# EAGLE schematic axiom_beta_power_board_v0.15_test.e9a06f0d (EAGLE 7.0.0)

## Sheet 1 of 10
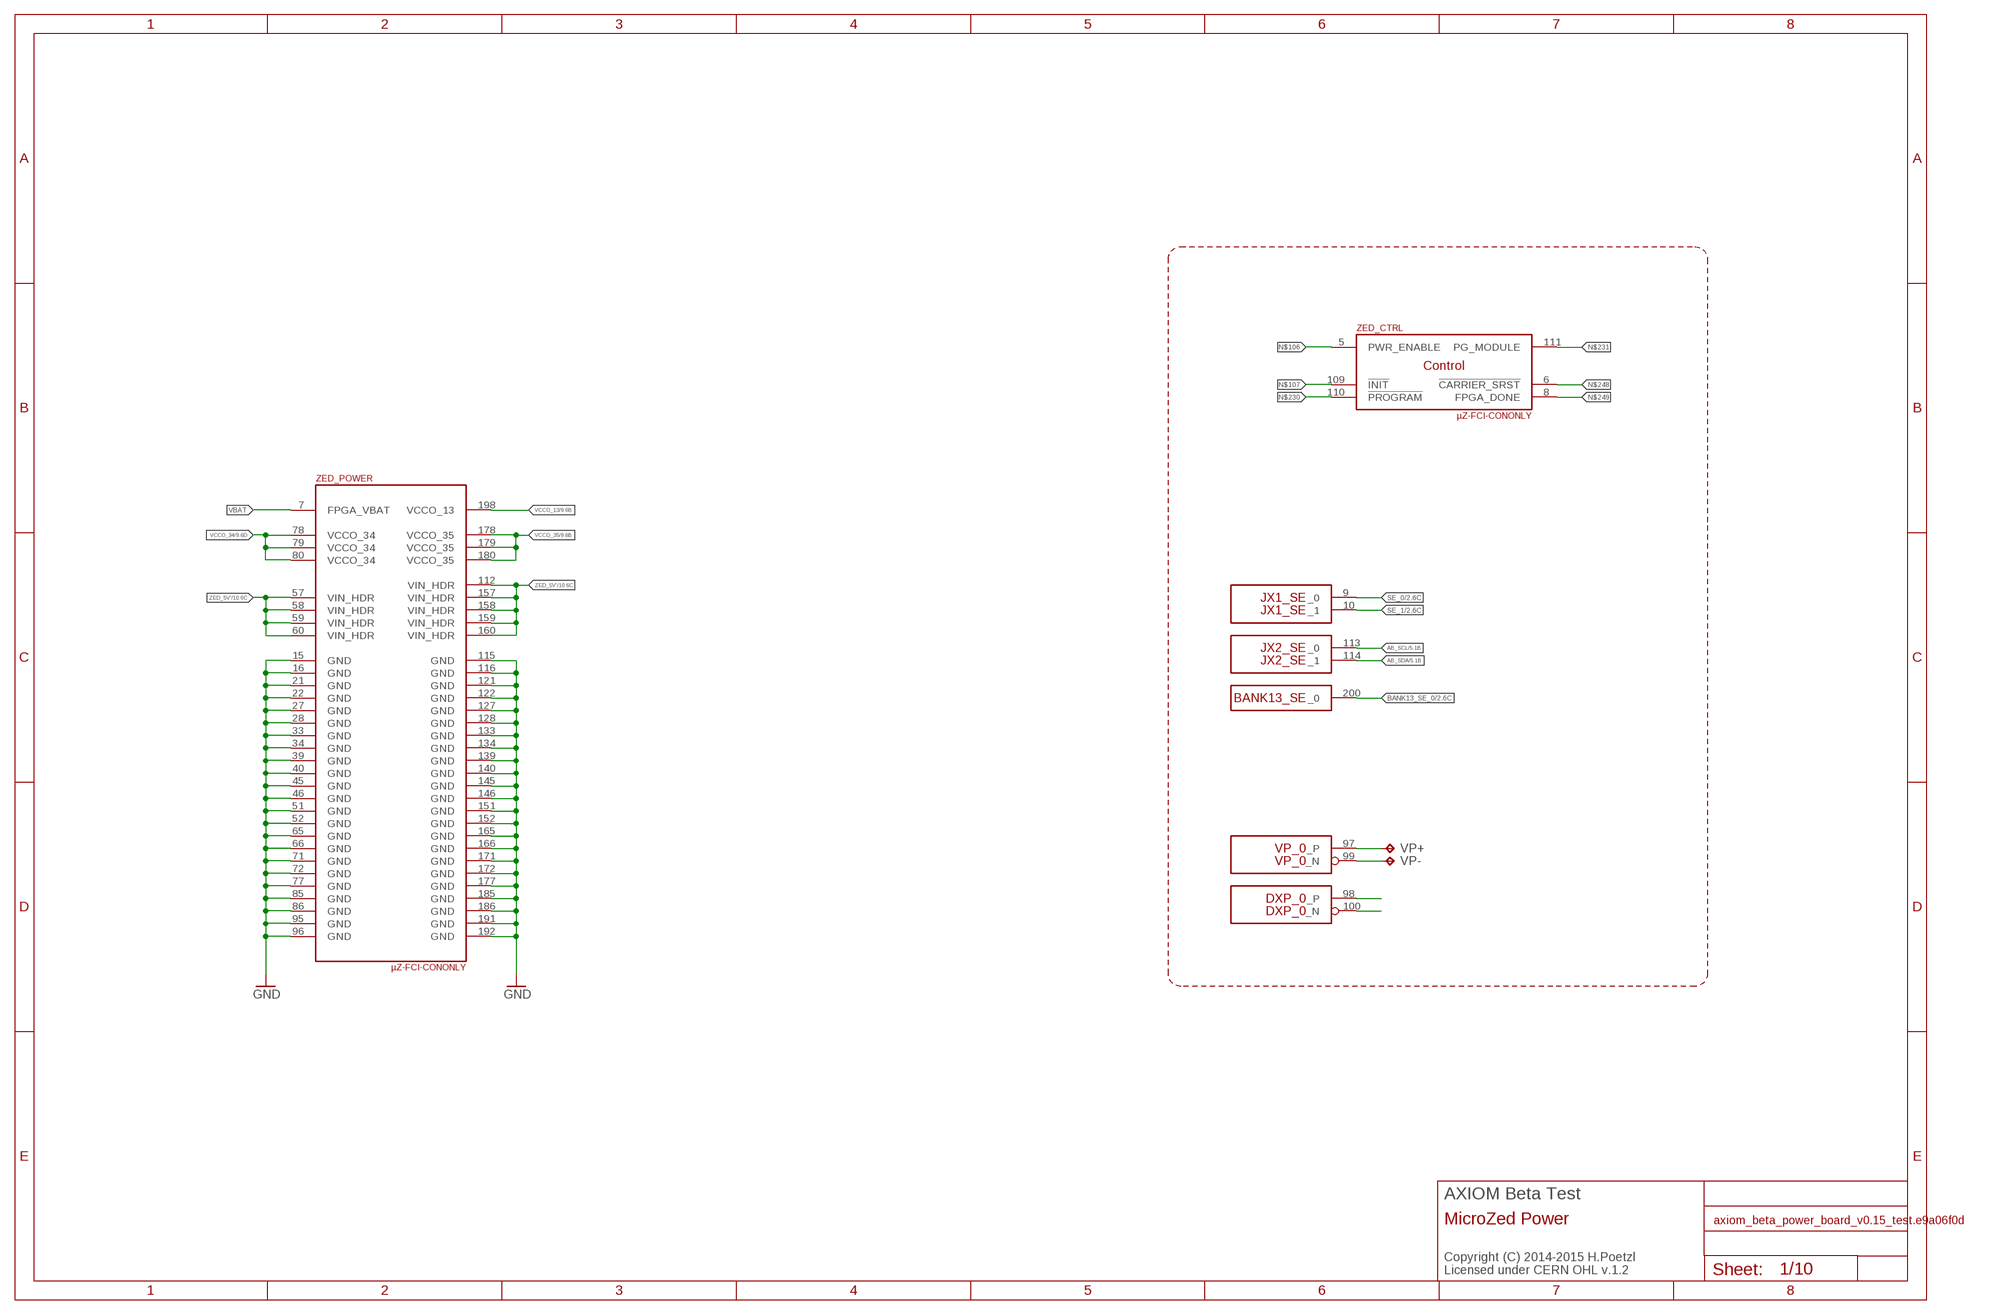
[diagram p0: schematic, sheet 1]

### Parts
VP+  TPTP16SQ  [TP16SQ]
VP-  TPTP16SQ  [TP16SQ]
ZED  µZ-FCI-CONONLY  [µZ-CONONLY]

### Nets
AB_SCL: ZED.113(JX2_SE:_0) ; also sheet 5
AB_SDA: ZED.114(JX2_SE:_1) ; also sheet 5
BANK13_SE_0: ZED.200(BANK13_SE:_0) ; also sheet 2
GND: ZED.15(_POWER:GND) ZED.16(_POWER:GND) ZED.21(_POWER:GND) ZED.22(_POWER:GND) ZED.27(_POWER:GND) ZED.28(_POWER:GND) ZED.33(_POWER:GND) ZED.34(_POWER:GND) ZED.39(_POWER:GND) ZED.40(_POWER:GND) ZED.45(_POWER:GND) ZED.46(_POWER:GND) ZED.51(_POWER:GND) ZED.52(_POWER:GND) ZED.65(_POWER:GND) ZED.66(_POWER:GND) ZED.71(_POWER:GND) ZED.72(_POWER:GND) ZED.77(_POWER:GND) ZED.85(_POWER:GND) ZED.86(_POWER:GND) ZED.95(_POWER:GND) ZED.96(_POWER:GND) ZED.115(_POWER:GND) ZED.116(_POWER:GND) ZED.121(_POWER:GND) ZED.122(_POWER:GND) ZED.127(_POWER:GND) ZED.128(_POWER:GND) ZED.133(_POWER:GND) ZED.134(_POWER:GND) ZED.139(_POWER:GND) ZED.140(_POWER:GND) ZED.145(_POWER:GND) ZED.146(_POWER:GND) ZED.151(_POWER:GND) ZED.152(_POWER:GND) ZED.165(_POWER:GND) ZED.166(_POWER:GND) ZED.171(_POWER:GND) ZED.172(_POWER:GND) ZED.177(_POWER:GND) ZED.185(_POWER:GND) ZED.186(_POWER:GND) ZED.191(_POWER:GND) ZED.192(_POWER:GND) ; also sheet 2,3,5,6,7,8,9,10
N$50: VP+.TP ZED.97(VP_0:_P)
N$51: VP-.TP ZED.99(VP_0:_N)
N$52: ZED.98(DXP_0:_P)
N$53: ZED.100(DXP_0:_N)
N$106: ZED.5(_CTRL:PWR_ENABLE)
N$107: ZED.109(_CTRL:!INIT)
N$230: ZED.110(_CTRL:!PROGRAM)
N$231: ZED.111(_CTRL:PG_MODULE)
N$248: ZED.6(_CTRL:!CARRIER_SRST)
N$249: ZED.8(_CTRL:FPGA_DONE)
SE_0: ZED.9(JX1_SE:_0) ; also sheet 2
SE_1: ZED.10(JX1_SE:_1) ; also sheet 2
VBAT: ZED.7(_POWER:FPGA_VBAT)
VCCO_13 [LVDS]: ZED.198(_POWER:VCCO_13) ; also sheet 9
VCCO_34: ZED.78(_POWER:VCCO_34) ZED.79(_POWER:VCCO_34) ZED.80(_POWER:VCCO_34) ; also sheet 9
VCCO_35: ZED.178(_POWER:VCCO_35) ZED.179(_POWER:VCCO_35) ZED.180(_POWER:VCCO_35) ; also sheet 9
ZED_5V': ZED.57(_POWER:VIN_HDR) ZED.58(_POWER:VIN_HDR) ZED.59(_POWER:VIN_HDR) ZED.60(_POWER:VIN_HDR) ZED.112(_POWER:VIN_HDR) ZED.157(_POWER:VIN_HDR) ZED.158(_POWER:VIN_HDR) ZED.159(_POWER:VIN_HDR) ZED.160(_POWER:VIN_HDR) ; also sheet 10

### Notes on the sheet
- AXIOM Beta Test
- MicroZed Power
- Copyright (C) 2014-2015 H.Poetzl
  Licensed under CERN OHL v.1.2

## Sheet 2 of 10
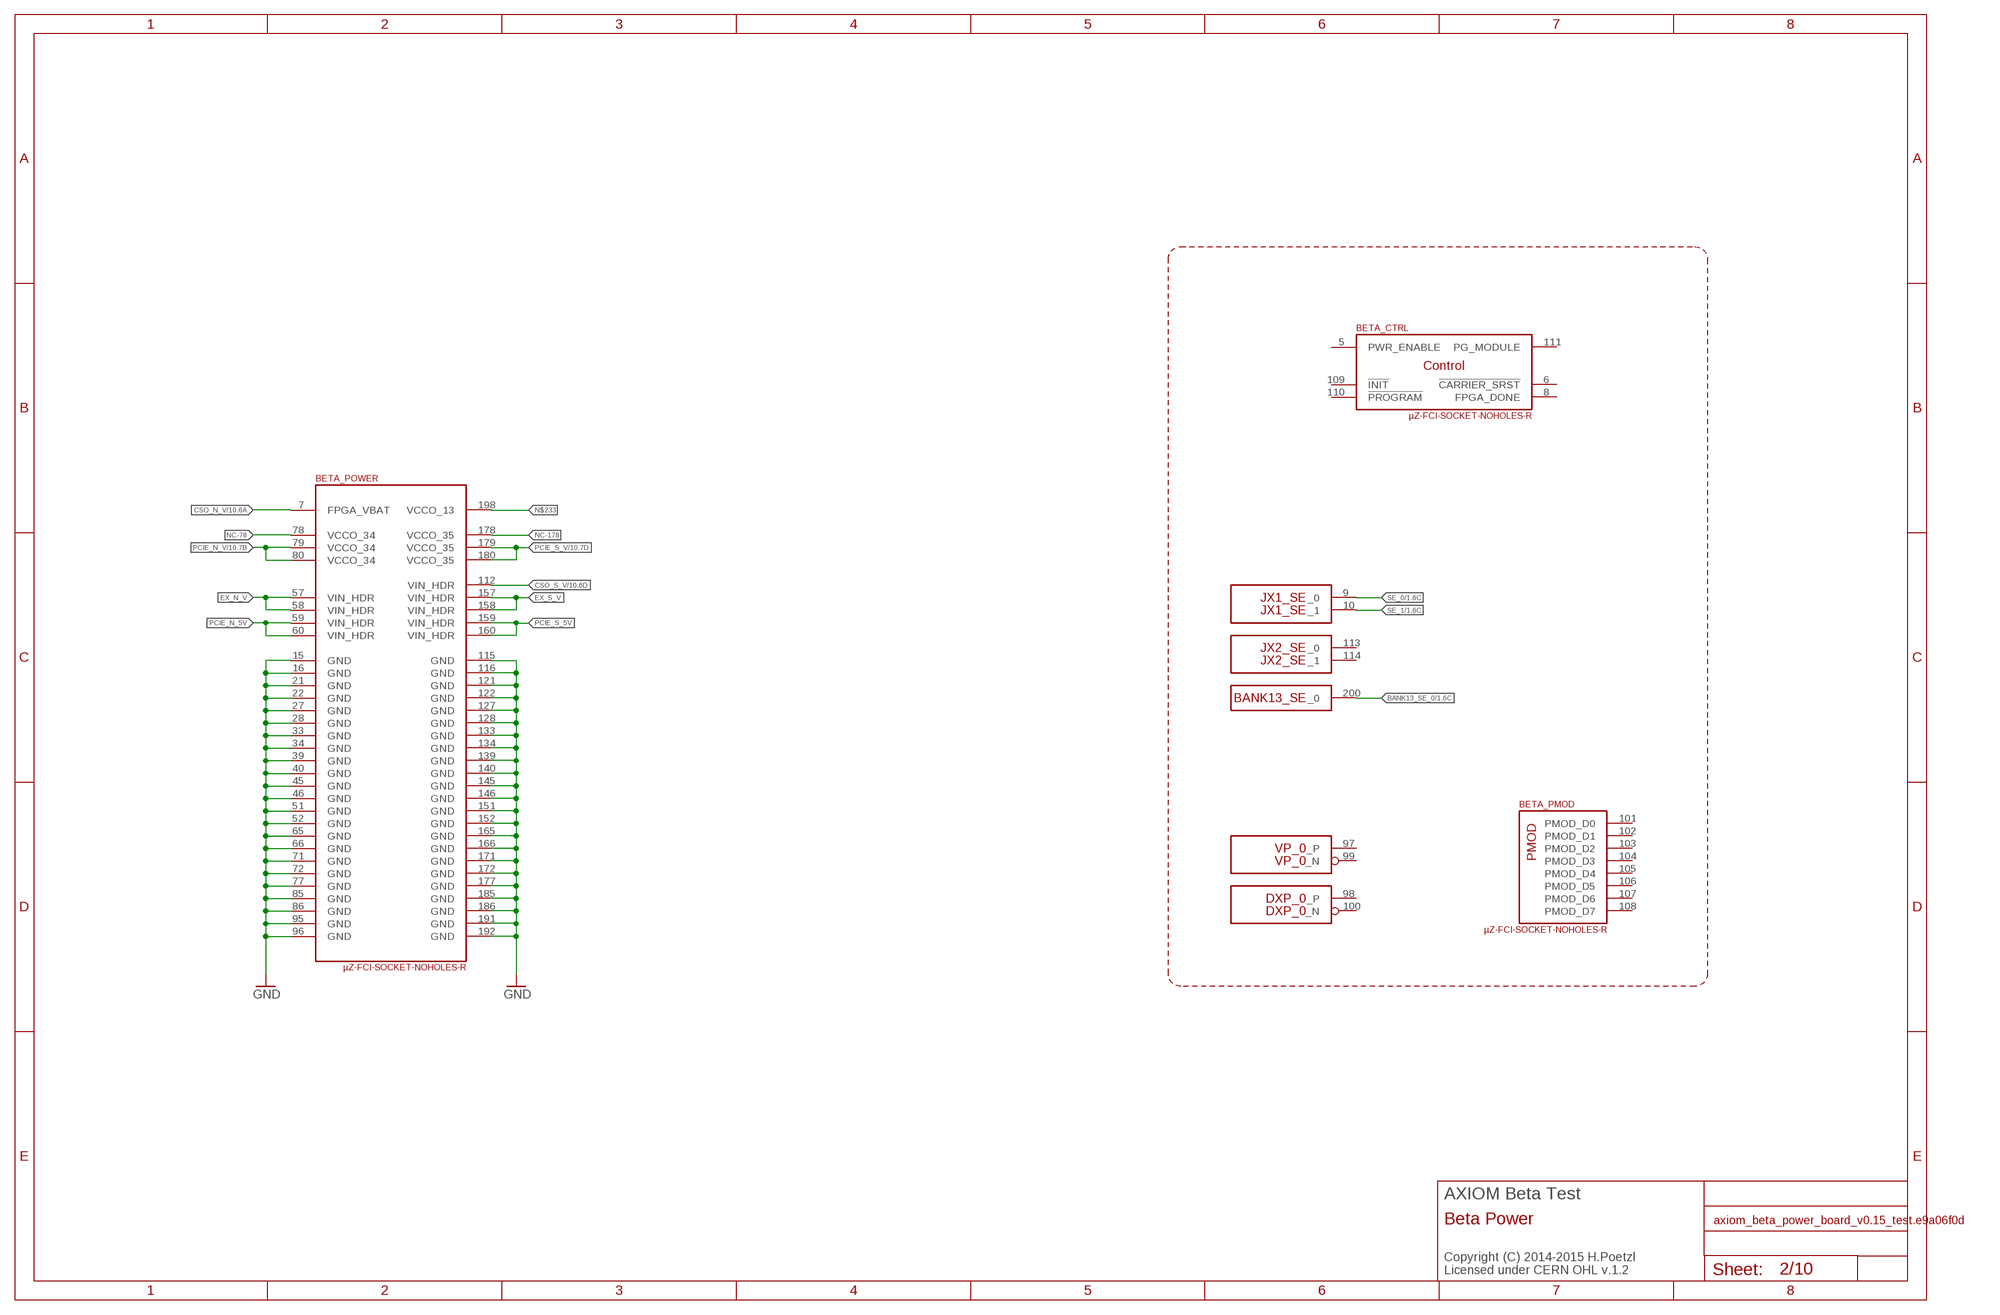
[diagram p1: schematic, sheet 2]

### Parts
BETA  µZ-FCI-SOCKET-NOHOLES-R  [µZ-SOCKET-NOHOLES-R]

### Nets
BANK13_SE_0: BETA.200(BANK13_SE:_0) ; also sheet 1
CSO_N_V: BETA.7(_POWER:FPGA_VBAT) ; also sheet 10
CSO_S_V: BETA.112(_POWER:VIN_HDR) ; also sheet 10
EX_N_V: BETA.57(_POWER:VIN_HDR) BETA.58(_POWER:VIN_HDR)
EX_S_V: BETA.157(_POWER:VIN_HDR) BETA.158(_POWER:VIN_HDR)
GND: BETA.15(_POWER:GND) BETA.16(_POWER:GND) BETA.21(_POWER:GND) BETA.22(_POWER:GND) BETA.27(_POWER:GND) BETA.28(_POWER:GND) BETA.33(_POWER:GND) BETA.34(_POWER:GND) BETA.39(_POWER:GND) BETA.40(_POWER:GND) BETA.45(_POWER:GND) BETA.46(_POWER:GND) BETA.51(_POWER:GND) BETA.52(_POWER:GND) BETA.65(_POWER:GND) BETA.66(_POWER:GND) BETA.71(_POWER:GND) BETA.72(_POWER:GND) BETA.77(_POWER:GND) BETA.85(_POWER:GND) BETA.86(_POWER:GND) BETA.95(_POWER:GND) BETA.96(_POWER:GND) BETA.115(_POWER:GND) BETA.116(_POWER:GND) BETA.121(_POWER:GND) BETA.122(_POWER:GND) BETA.127(_POWER:GND) BETA.128(_POWER:GND) BETA.133(_POWER:GND) BETA.134(_POWER:GND) BETA.139(_POWER:GND) BETA.140(_POWER:GND) BETA.145(_POWER:GND) BETA.146(_POWER:GND) BETA.151(_POWER:GND) BETA.152(_POWER:GND) BETA.165(_POWER:GND) BETA.166(_POWER:GND) BETA.171(_POWER:GND) BETA.172(_POWER:GND) BETA.177(_POWER:GND) BETA.185(_POWER:GND) BETA.186(_POWER:GND) BETA.191(_POWER:GND) BETA.192(_POWER:GND) ; also sheet 1,3,5,6,7,8,9,10
N$233: BETA.198(_POWER:VCCO_13)
NC-78: BETA.78(_POWER:VCCO_34)
NC-178: BETA.178(_POWER:VCCO_35)
PCIE_N_5V: BETA.59(_POWER:VIN_HDR) BETA.60(_POWER:VIN_HDR)
PCIE_N_V: BETA.79(_POWER:VCCO_34) BETA.80(_POWER:VCCO_34) ; also sheet 10
PCIE_S_5V: BETA.159(_POWER:VIN_HDR) BETA.160(_POWER:VIN_HDR)
PCIE_S_V: BETA.179(_POWER:VCCO_35) BETA.180(_POWER:VCCO_35) ; also sheet 10
SE_0: BETA.9(JX1_SE:_0) ; also sheet 1
SE_1: BETA.10(JX1_SE:_1) ; also sheet 1
Unconnected: BETA.5(_CTRL:PWR_ENABLE) BETA.6(_CTRL:!CARRIER_SRST) BETA.8(_CTRL:FPGA_DONE) BETA.97(VP_0:_P) BETA.98(DXP_0:_P) BETA.99(VP_0:_N) BETA.100(DXP_0:_N) BETA.101(_PMOD:PMOD_D0) BETA.102(_PMOD:PMOD_D1) BETA.103(_PMOD:PMOD_D2) BETA.104(_PMOD:PMOD_D3) BETA.105(_PMOD:PMOD_D4) BETA.106(_PMOD:PMOD_D5) BETA.107(_PMOD:PMOD_D6) BETA.108(_PMOD:PMOD_D7) BETA.109(_CTRL:!INIT) BETA.110(_CTRL:!PROGRAM) BETA.111(_CTRL:PG_MODULE) BETA.113(JX2_SE:_0) BETA.114(JX2_SE:_1)

### Notes on the sheet
- AXIOM Beta Test
- Beta Power
- Copyright (C) 2014-2015 H.Poetzl
  Licensed under CERN OHL v.1.2

## Sheet 3 of 10
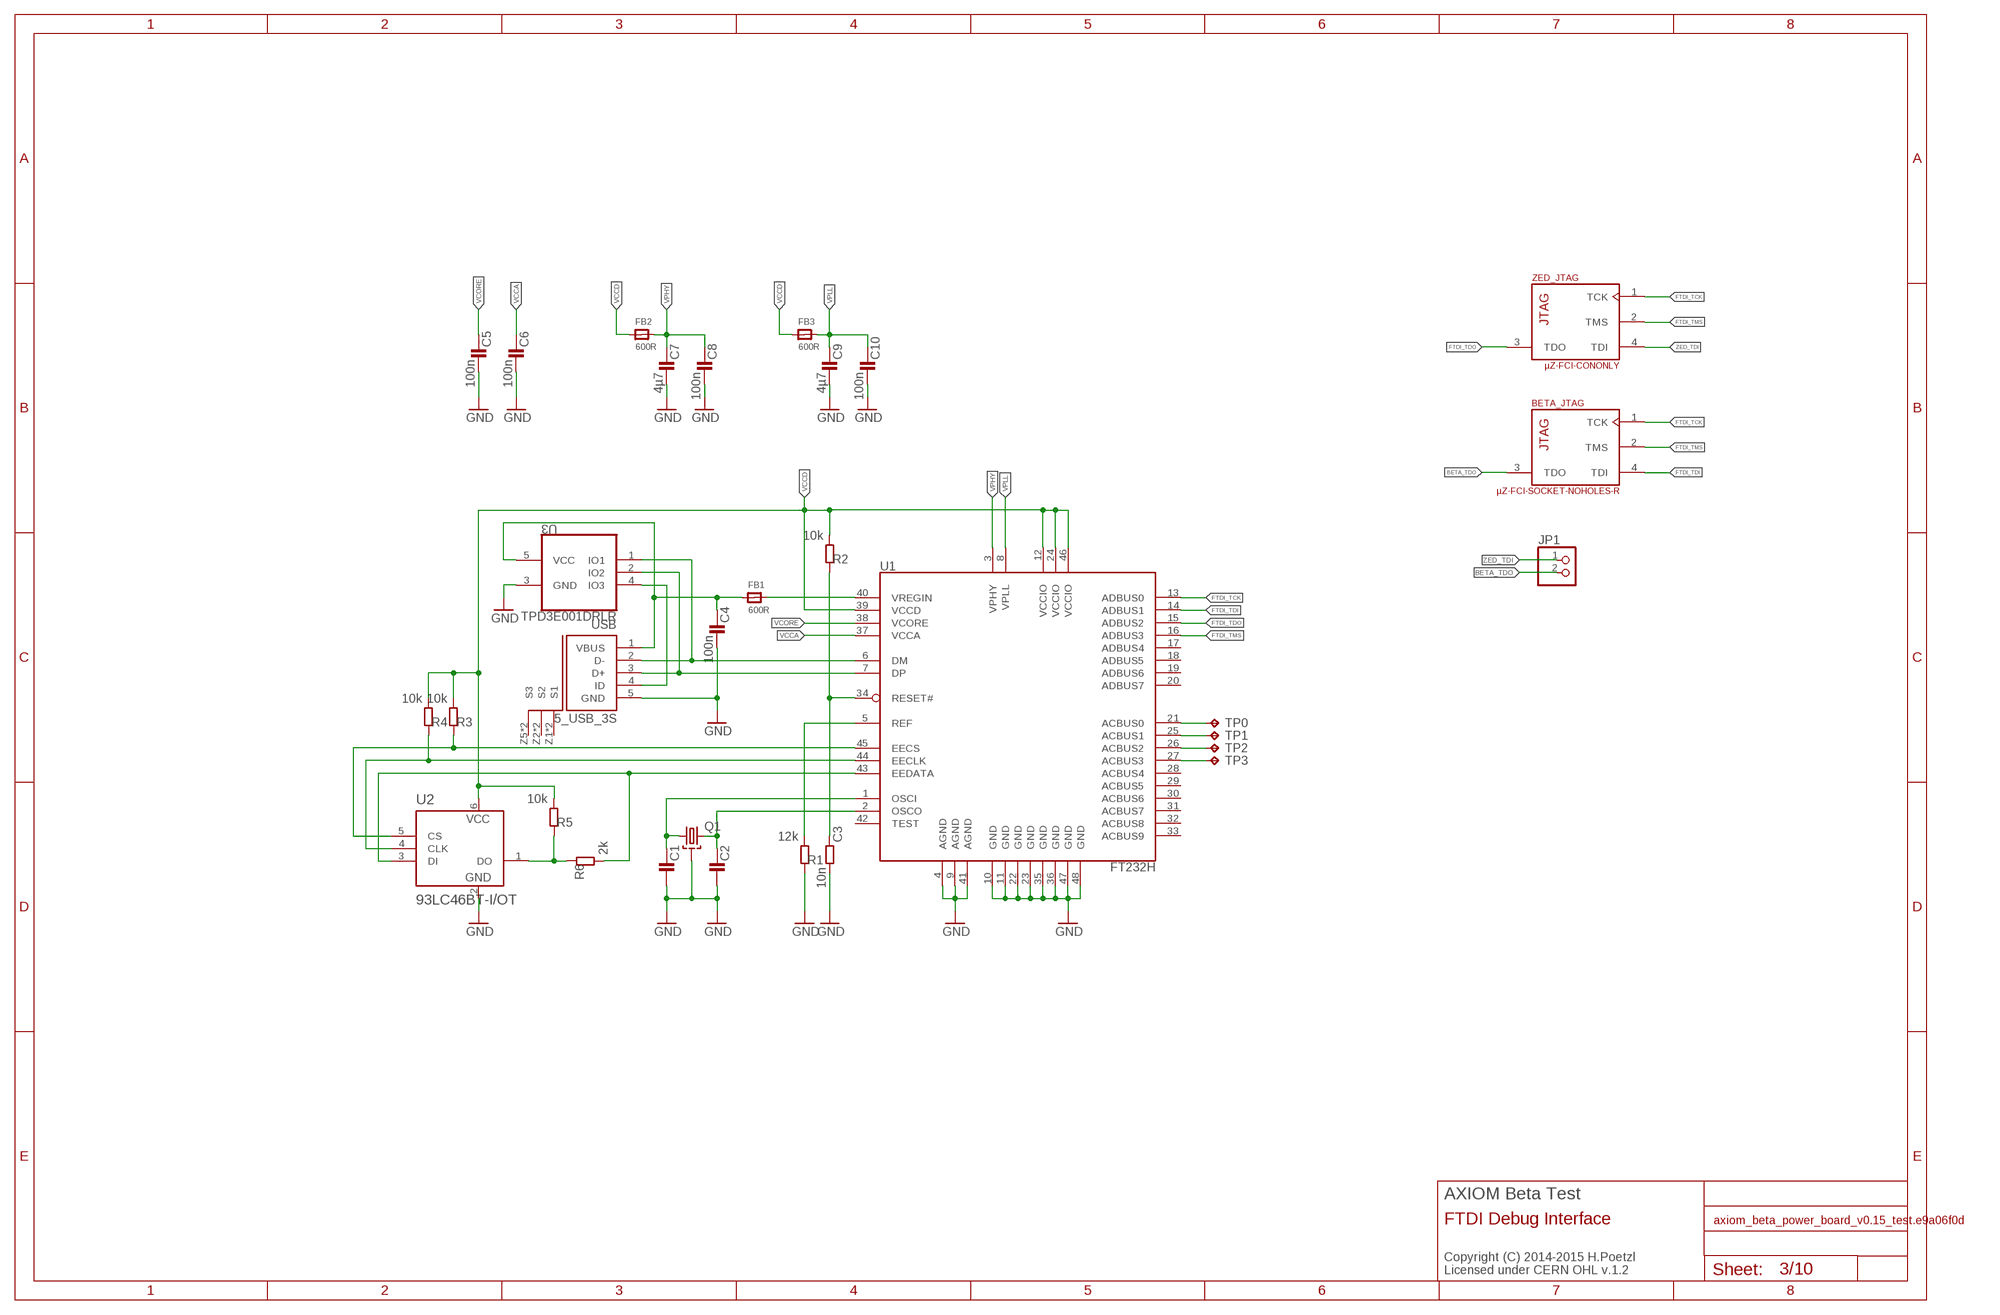
[diagram p2: schematic, sheet 3]

### Parts
C1  C0402-B  [0402-B]
C2  C0402-B  [0402-B]
C3  10n  R0402-B  [0402-B]
C4  100n  C0603-B  [0603-B]
C5  100n  C0402-B  [0402-B]
C6  100n  C0402-B  [0402-B]
C7  4µ7  C0603-B  [0603-B]
C8  100n  C0402-B  [0402-B]
C9  4µ7  C0603-B  [0603-B]
C10  100n  C0402-B  [0402-B]
FB1  600R  FERRITE_0603MP  [_0603MP]
FB2  600R  FERRITE_0603MP  [_0603MP]
FB3  600R  FERRITE_0603MP  [_0603MP]
JP1  PINHD-1X02_2.00  [1X02M]
Q1  SMD-4P-2G-3.2X2.5  [ABM8G]
R1  12k  R0402-B  [0402-B]
R2  10k  R0402-B  [0402-B]
R3  10k  R0402-B  [0402-B]
R4  10k  R0402-B  [0402-B]
R5  10k  R0402-B  [0402-B]
R6  2k  R0402-B  [0402-B]
TP0  TPTP16SQ  [TP16SQ]
TP1  TPTP16SQ  [TP16SQ]
TP2  TPTP16SQ  [TP16SQ]
TP3  TPTP16SQ  [TP16SQ]
U1  FT232H  [LQFP48]
U2  93LC46BT-I/OT  [SOT95P280X145-6N]
U3  TPD3E001DRLR  [SOT50P160X60-5N]
USB  5_USB_3S  [MICRO-AB-H-SMT]

### Nets
BETA_TDO: BETA.3(_JTAG:TDO) JP1.2
EE_CLK1: R4.1 U1.44(EECLK) U2.4(CLK)
EE_CS1: R3.1 U1.45(EECS) U2.5(CS)
EE_DATA1: R6.2 U1.43(EEDATA) U2.3(DI)
FTDI_D_N: U1.6(DM) U3.1(IO1) USB.2(D-)
FTDI_D_P: U1.7(DP) U3.2(IO2) USB.3(D+)
FTDI_TCK: BETA.1(_JTAG:TCK) U1.13(ADBUS0) ZED.1(_JTAG:TCK)
FTDI_TDI: BETA.4(_JTAG:TDI) U1.14(ADBUS1)
FTDI_TDO: U1.15(ADBUS2) ZED.3(_JTAG:TDO)
FTDI_TMS: BETA.2(_JTAG:TMS) U1.16(ADBUS3) ZED.2(_JTAG:TMS)
GND: C1.2 C2.2 C3.2 C4.2 C5.2 C6.2 C7.2 C8.2 C9.2 C10.2 Q1.2(GND) Q1.4(GND) R1.1 U1.4(AGND) U1.9(AGND) U1.10(GND) U1.11(GND) U1.22(GND) U1.23(GND) U1.35(GND) U1.36(GND) U1.41(AGND) U1.47(GND) U1.48(GND) U2.2(VSS) U3.3(GND) USB.5(GND) ; also sheet 1,2,5,6,7,8,9,10
N$35: TP1.TP U1.25(ACBUS1)
N$37: TP2.TP U1.26(ACBUS2)
N$77: TP3.TP U1.27(ACBUS3)
N$99: TP0.TP U1.21(ACBUS0)
N$177: R5.1 R6.1 U2.1(DO)
N$178: C1.1 Q1.1 U1.1(OSCI)
N$179: C2.1 Q1.3 U1.2(OSCO)
N$180: C3.1 R2.1 U1.34(RESET#)
N$181: R1.2 U1.5(REF)
N$182: U3.4(IO3) USB.4(ID)
VBUS: C4.1 FB1.1 U3.5(VCC) USB.1(VBUS)
VCCA: C6.1 U1.37(VCCA)
VCCD: FB2.1 FB3.1 R2.2 R3.2 R4.2 R5.2 U1.12(VCCIO) U1.24(VCCIO) U1.39(VCCD) U1.46(VCCIO) U2.6(VCC)
VCORE: C5.1 U1.38(VCORE)
VPHY: C7.1 C8.1 FB2.2 U1.3(VPHY)
VPLL: C9.1 C10.1 FB3.2 U1.8(VPLL)
VREGIN: FB1.2 U1.40(VREGIN)
ZED_TDI: JP1.1 ZED.4(_JTAG:TDI)
Unconnected: U1.17(ADBUS4) U1.18(ADBUS5) U1.19(ADBUS6) U1.20(ADBUS7) U1.28(ACBUS4) U1.29(ACBUS5) U1.30(ACBUS6) U1.31(ACBUS7) U1.32(ACBUS8) U1.33(ACBUS9) U1.42(TEST) USB.Z1(S1) USB.Z2(S2) USB.Z3(S2) USB.Z4(S1) USB.Z5(S3) USB.Z6(S3)

### Notes on the sheet
- AXIOM Beta Test
- FTDI Debug Interface
- Copyright (C) 2014-2015 H.Poetzl
  Licensed under CERN OHL v.1.2

## Sheet 4 of 10
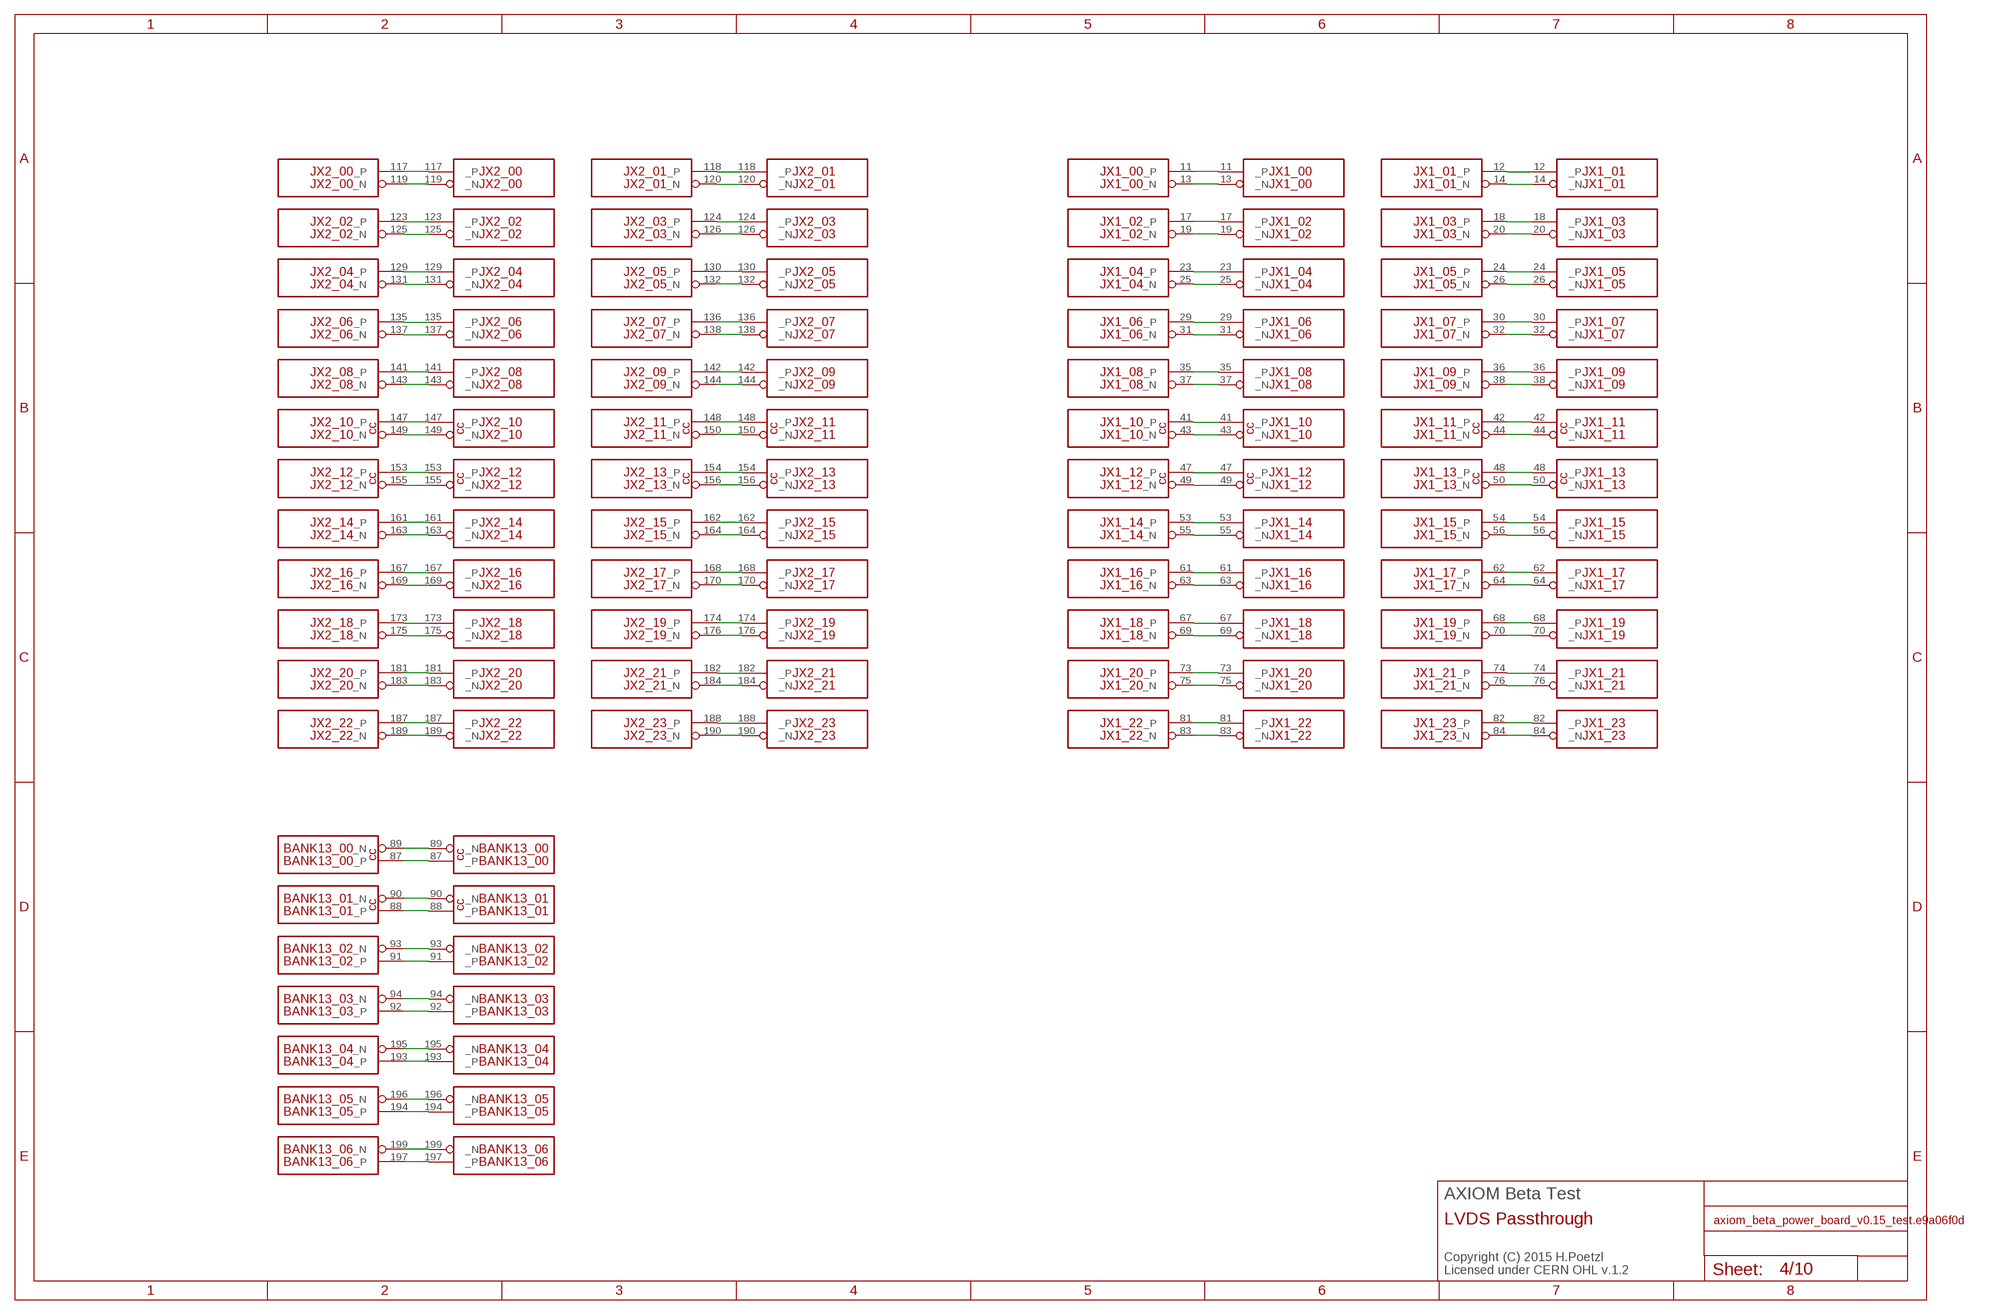
[diagram p3: schematic, sheet 4]

### Nets
BANK13_00_N [LVDS]: BETA.87(BANK13_00:_P) ZED.87(BANK13_00:_P)
BANK13_00_P [LVDS]: BETA.89(BANK13_00:_N) ZED.89(BANK13_00:_N)
BANK13_01_N [LVDS]: BETA.90(BANK13_01:_N) ZED.90(BANK13_01:_N)
BANK13_01_P [LVDS]: BETA.88(BANK13_01:_P) ZED.88(BANK13_01:_P)
BANK13_02_N [LVDS]: BETA.91(BANK13_02:_P) ZED.91(BANK13_02:_P)
BANK13_02_P [LVDS]: BETA.93(BANK13_02:_N) ZED.93(BANK13_02:_N)
BANK13_03_N [LVDS]: BETA.92(BANK13_03:_P) ZED.92(BANK13_03:_P)
BANK13_03_P [LVDS]: BETA.94(BANK13_03:_N) ZED.94(BANK13_03:_N)
BANK13_04_N [LVDS]: BETA.193(BANK13_04:_P) ZED.193(BANK13_04:_P)
BANK13_04_P [LVDS]: BETA.195(BANK13_04:_N) ZED.195(BANK13_04:_N)
BANK13_05_N: BETA.196(BANK13_05:_N) ZED.196(BANK13_05:_N)
BANK13_05_P: BETA.194(BANK13_05:_P) ZED.194(BANK13_05:_P)
BANK13_06_N [LVDS]: BETA.199(BANK13_06:_N) ZED.199(BANK13_06:_N)
BANK13_06_P [LVDS]: BETA.197(BANK13_06:_P) ZED.197(BANK13_06:_P)
JX1_00_N [LVDS]: BETA.13(JX1_00:_N) ZED.13(JX1_00:_N)
JX1_00_P [LVDS]: BETA.11(JX1_00:_P) ZED.11(JX1_00:_P)
JX1_01_N [LVDS]: BETA.14(JX1_01:_N) ZED.14(JX1_01:_N)
JX1_01_P [LVDS]: BETA.12(JX1_01:_P) ZED.12(JX1_01:_P)
JX1_02_N [LVDS]: BETA.19(JX1_02:_N) ZED.19(JX1_02:_N)
JX1_02_P [LVDS]: BETA.17(JX1_02:_P) ZED.17(JX1_02:_P)
JX1_03_N [LVDS]: BETA.20(JX1_03:_N) ZED.20(JX1_03:_N)
JX1_03_P [LVDS]: BETA.18(JX1_03:_P) ZED.18(JX1_03:_P)
JX1_04_N [LVDS]: BETA.25(JX1_04:_N) ZED.25(JX1_04:_N)
JX1_04_P [LVDS]: BETA.23(JX1_04:_P) ZED.23(JX1_04:_P)
JX1_05_N: BETA.26(JX1_05:_N) ZED.26(JX1_05:_N)
JX1_05_P: BETA.24(JX1_05:_P) ZED.24(JX1_05:_P)
JX1_06_N [LVDS]: BETA.31(JX1_06:_N) ZED.31(JX1_06:_N)
JX1_06_P [LVDS]: BETA.29(JX1_06:_P) ZED.29(JX1_06:_P)
JX1_07_N [LVDS]: BETA.32(JX1_07:_N) ZED.32(JX1_07:_N)
JX1_07_P [LVDS]: BETA.30(JX1_07:_P) ZED.30(JX1_07:_P)
JX1_08_N: BETA.37(JX1_08:_N) ZED.37(JX1_08:_N)
JX1_08_P: BETA.35(JX1_08:_P) ZED.35(JX1_08:_P)
JX1_09_N [LVDS]: BETA.38(JX1_09:_N) ZED.38(JX1_09:_N)
JX1_09_P [LVDS]: BETA.36(JX1_09:_P) ZED.36(JX1_09:_P)
JX1_10_N [LVDS]: BETA.43(JX1_10:_N) ZED.43(JX1_10:_N)
JX1_10_P [LVDS]: BETA.41(JX1_10:_P) ZED.41(JX1_10:_P)
JX1_11_N [LVDS]: BETA.44(JX1_11:_N) ZED.44(JX1_11:_N)
JX1_11_P [LVDS]: BETA.42(JX1_11:_P) ZED.42(JX1_11:_P)
JX1_12_N [LVDS]: BETA.49(JX1_12:_N) ZED.49(JX1_12:_N)
JX1_12_P [LVDS]: BETA.47(JX1_12:_P) ZED.47(JX1_12:_P)
JX1_13_N [LVDS]: BETA.50(JX1_13:_N) ZED.50(JX1_13:_N)
JX1_13_P [LVDS]: BETA.48(JX1_13:_P) ZED.48(JX1_13:_P)
JX1_14_N [LVDS]: BETA.55(JX1_14:_N) ZED.55(JX1_14:_N)
JX1_14_P [LVDS]: BETA.53(JX1_14:_P) ZED.53(JX1_14:_P)
JX1_15_N: BETA.56(JX1_15:_N) ZED.56(JX1_15:_N)
JX1_15_P: BETA.54(JX1_15:_P) ZED.54(JX1_15:_P)
JX1_16_N [LVDS]: BETA.63(JX1_16:_N) ZED.63(JX1_16:_N)
JX1_16_P [LVDS]: BETA.61(JX1_16:_P) ZED.61(JX1_16:_P)
JX1_17_N [LVDS]: BETA.64(JX1_17:_N) ZED.64(JX1_17:_N)
JX1_17_P [LVDS]: BETA.62(JX1_17:_P) ZED.62(JX1_17:_P)
JX1_18_N [LVDS]: BETA.69(JX1_18:_N) ZED.69(JX1_18:_N)
JX1_18_P [LVDS]: BETA.67(JX1_18:_P) ZED.67(JX1_18:_P)
JX1_19_N [LVDS]: BETA.70(JX1_19:_N) ZED.70(JX1_19:_N)
JX1_19_P [LVDS]: BETA.68(JX1_19:_P) ZED.68(JX1_19:_P)
JX1_20_N: BETA.75(JX1_20:_N) ZED.75(JX1_20:_N)
JX1_20_P: BETA.73(JX1_20:_P) ZED.73(JX1_20:_P)
JX1_21_N: BETA.76(JX1_21:_N) ZED.76(JX1_21:_N)
JX1_21_P: BETA.74(JX1_21:_P) ZED.74(JX1_21:_P)
JX1_22_N: BETA.83(JX1_22:_N) ZED.83(JX1_22:_N)
JX1_22_P: BETA.81(JX1_22:_P) ZED.81(JX1_22:_P)
JX1_23_N [LVDS]: BETA.84(JX1_23:_N) ZED.84(JX1_23:_N)
JX1_23_P [LVDS]: BETA.82(JX1_23:_P) ZED.82(JX1_23:_P)
JX2_00_N [LVDS]: BETA.119(JX2_00:_N) ZED.119(JX2_00:_N)
JX2_00_P [LVDS]: BETA.117(JX2_00:_P) ZED.117(JX2_00:_P)
JX2_01_N [LVDS]: BETA.120(JX2_01:_N) ZED.120(JX2_01:_N)
JX2_01_P [LVDS]: BETA.118(JX2_01:_P) ZED.118(JX2_01:_P)
JX2_02_N [LVDS]: BETA.125(JX2_02:_N) ZED.125(JX2_02:_N)
JX2_02_P [LVDS]: BETA.123(JX2_02:_P) ZED.123(JX2_02:_P)
JX2_03_N [LVDS]: BETA.126(JX2_03:_N) ZED.126(JX2_03:_N)
JX2_03_P [LVDS]: BETA.124(JX2_03:_P) ZED.124(JX2_03:_P)
JX2_04_N [LVDS]: BETA.131(JX2_04:_N) ZED.131(JX2_04:_N)
JX2_04_P [LVDS]: BETA.129(JX2_04:_P) ZED.129(JX2_04:_P)
JX2_05_N [LVDS]: BETA.132(JX2_05:_N) ZED.132(JX2_05:_N)
JX2_05_P [LVDS]: BETA.130(JX2_05:_P) ZED.130(JX2_05:_P)
JX2_06_N [LVDS]: BETA.137(JX2_06:_N) ZED.137(JX2_06:_N)
JX2_06_P [LVDS]: BETA.135(JX2_06:_P) ZED.135(JX2_06:_P)
JX2_07_N [LVDS]: BETA.138(JX2_07:_N) ZED.138(JX2_07:_N)
JX2_07_P [LVDS]: BETA.136(JX2_07:_P) ZED.136(JX2_07:_P)
JX2_08_N [LVDS]: BETA.143(JX2_08:_N) ZED.143(JX2_08:_N)
JX2_08_P [LVDS]: BETA.141(JX2_08:_P) ZED.141(JX2_08:_P)
JX2_09_N [LVDS]: BETA.144(JX2_09:_N) ZED.144(JX2_09:_N)
JX2_09_P [LVDS]: BETA.142(JX2_09:_P) ZED.142(JX2_09:_P)
JX2_10_N [LVDS]: BETA.149(JX2_10:_N) ZED.149(JX2_10:_N)
JX2_10_P [LVDS]: BETA.147(JX2_10:_P) ZED.147(JX2_10:_P)
JX2_11_N [LVDS]: BETA.150(JX2_11:_N) ZED.150(JX2_11:_N)
JX2_11_P [LVDS]: BETA.148(JX2_11:_P) ZED.148(JX2_11:_P)
JX2_12_N [LVDS]: BETA.155(JX2_12:_N) ZED.155(JX2_12:_N)
JX2_12_P [LVDS]: BETA.153(JX2_12:_P) ZED.153(JX2_12:_P)
JX2_13_N [LVDS]: BETA.156(JX2_13:_N) ZED.156(JX2_13:_N)
JX2_13_P [LVDS]: BETA.154(JX2_13:_P) ZED.154(JX2_13:_P)
JX2_14_N: BETA.163(JX2_14:_N) ZED.163(JX2_14:_N)
JX2_14_P: BETA.161(JX2_14:_P) ZED.161(JX2_14:_P)
JX2_15_N [LVDS]: BETA.164(JX2_15:_N) ZED.164(JX2_15:_N)
JX2_15_P [LVDS]: BETA.162(JX2_15:_P) ZED.162(JX2_15:_P)
JX2_16_N [LVDS]: BETA.169(JX2_16:_N) ZED.169(JX2_16:_N)
JX2_16_P [LVDS]: BETA.167(JX2_16:_P) ZED.167(JX2_16:_P)
JX2_17_N [LVDS]: BETA.170(JX2_17:_N) ZED.170(JX2_17:_N)
JX2_17_P [LVDS]: BETA.168(JX2_17:_P) ZED.168(JX2_17:_P)
JX2_18_N [LVDS]: BETA.175(JX2_18:_N) ZED.175(JX2_18:_N)
JX2_18_P [LVDS]: BETA.173(JX2_18:_P) ZED.173(JX2_18:_P)
JX2_19_N [LVDS]: BETA.176(JX2_19:_N) ZED.176(JX2_19:_N)
JX2_19_P [LVDS]: BETA.174(JX2_19:_P) ZED.174(JX2_19:_P)
JX2_20_N [LVDS]: BETA.183(JX2_20:_N) ZED.183(JX2_20:_N)
JX2_20_P [LVDS]: BETA.181(JX2_20:_P) ZED.181(JX2_20:_P)
JX2_21_N [LVDS]: BETA.184(JX2_21:_N) ZED.184(JX2_21:_N)
JX2_21_P [LVDS]: BETA.182(JX2_21:_P) ZED.182(JX2_21:_P)
JX2_22_N: BETA.189(JX2_22:_N) ZED.189(JX2_22:_N)
JX2_22_P: BETA.187(JX2_22:_P) ZED.187(JX2_22:_P)
JX2_23_N [LVDS]: BETA.190(JX2_23:_N) ZED.190(JX2_23:_N)
JX2_23_P [LVDS]: BETA.188(JX2_23:_P) ZED.188(JX2_23:_P)

### Notes on the sheet
- AXIOM Beta Test
- LVDS Passthrough
- Copyright (C) 2015 H.Poetzl
  Licensed under CERN OHL v.1.2

## Sheet 5 of 10
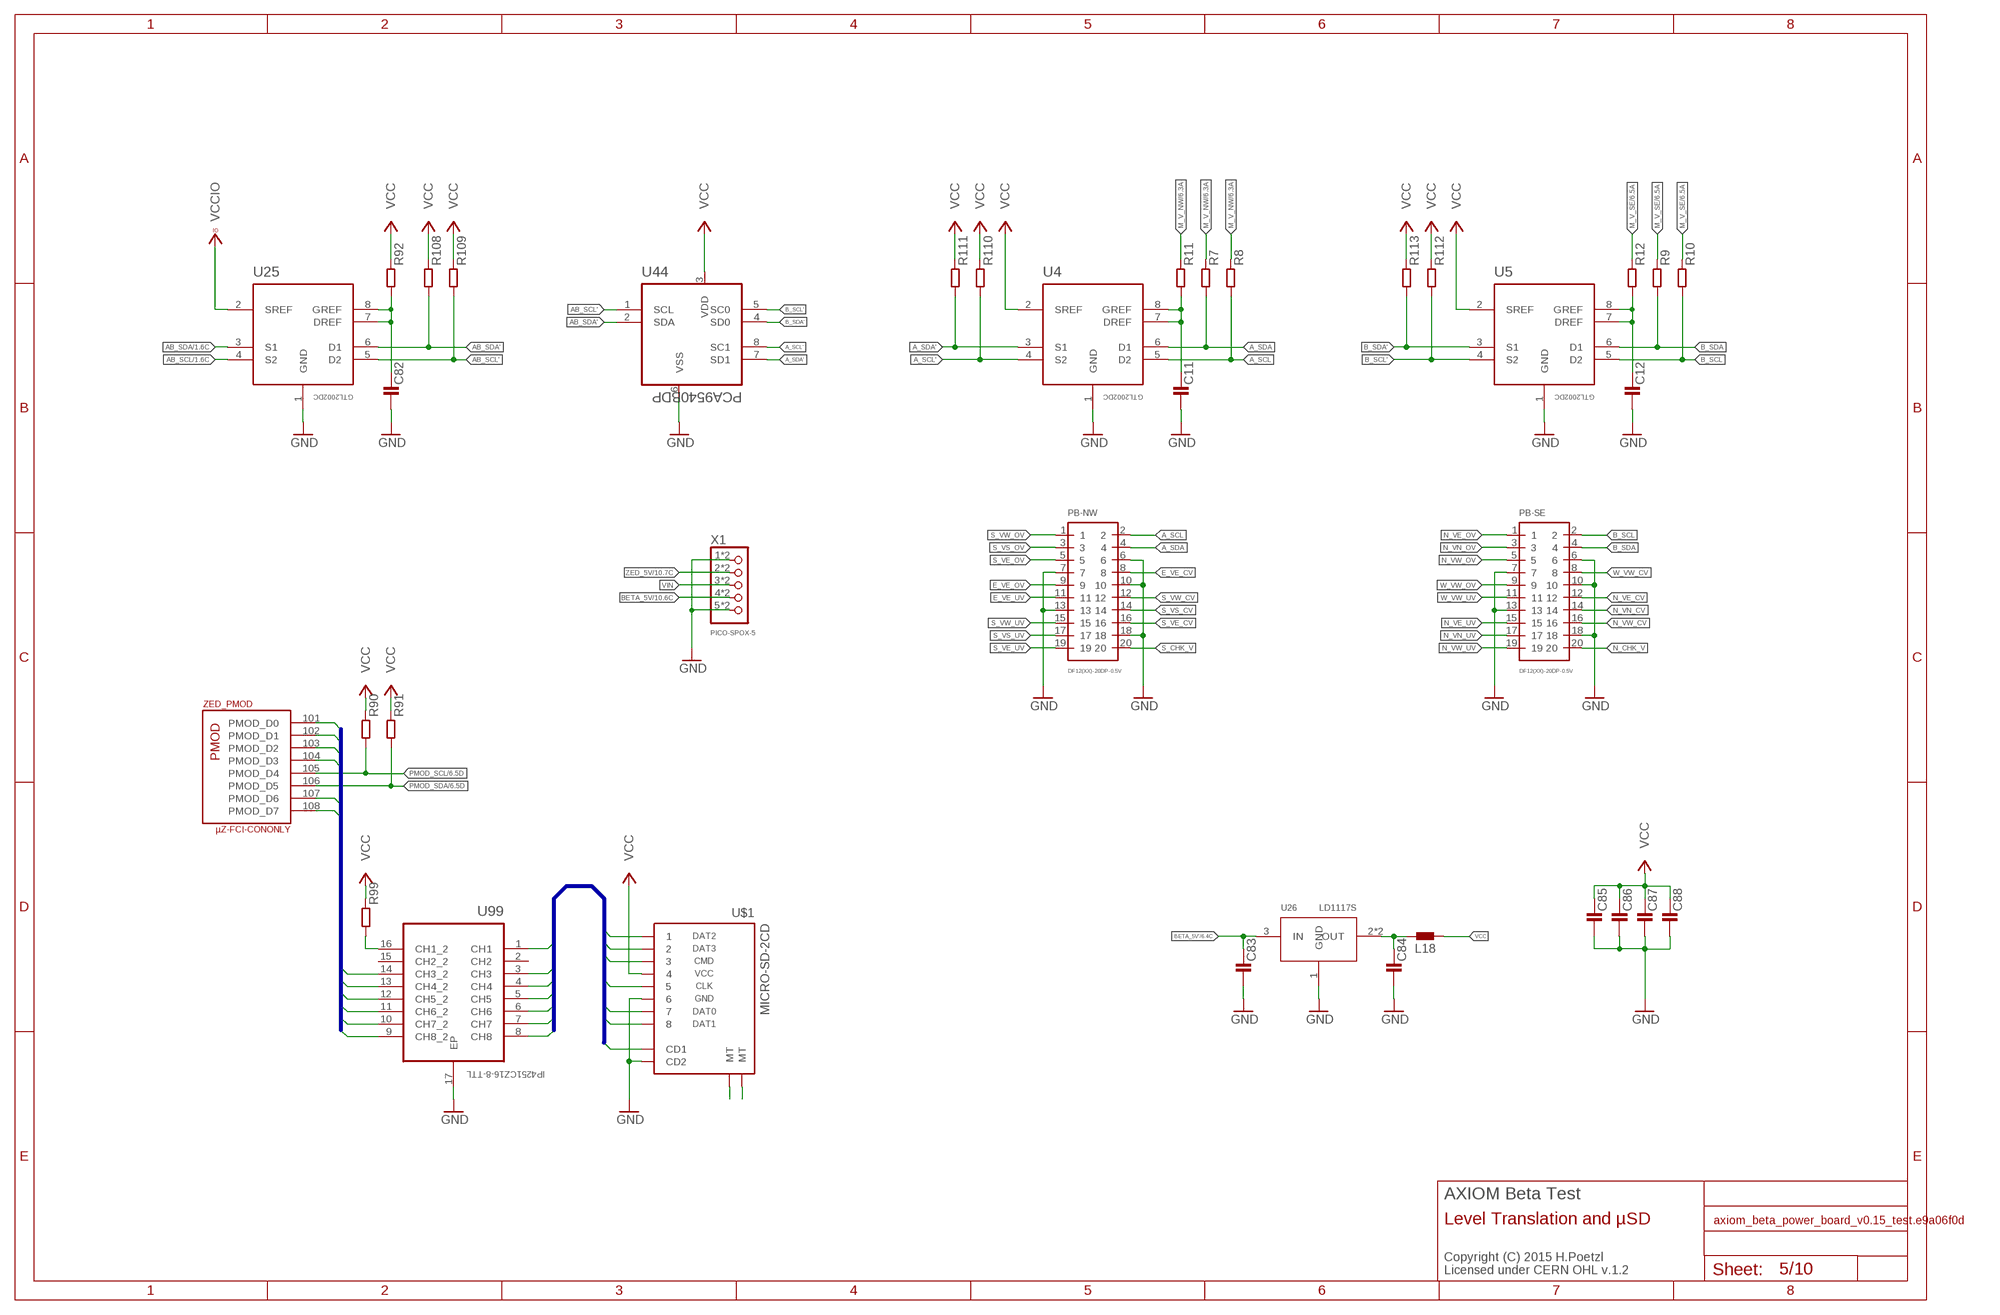
[diagram p4: schematic, sheet 5]

### Parts
C11  C0402-B  [0402-B]
C12  C0402-B  [0402-B]
C82  C0402-B  [0402-B]
C83  C0805-B  [0805-B]
C84  C0805-B  [0805-B]
C85  C0402-B  [0402-B]
C86  C0402-B  [0402-B]
C87  C0402-B  [0402-B]
C88  C0402-B  [0402-B]
L18  L0805-A  [0805-A]
PB-NW  DF12(XX)-20DP-0.5V  [DF12(XX)-20DP-0.5V]
PB-SE  DF12(XX)-20DP-0.5V  [DF12(XX)-20DP-0.5V]
R7  R0402-B  [0402-B]
R8  R0402-B  [0402-B]
R9  R0402-B  [0402-B]
R10  R0402-B  [0402-B]
R11  R0402-B  [0402-B]
R12  R0402-B  [0402-B]
R90  R0402-B  [0402-B]
R91  R0402-B  [0402-B]
R92  R0402-B  [0402-B]
R99  R0402-B  [0402-B]
R108  R0402-B  [0402-B]
R109  R0402-B  [0402-B]
R110  R0402-B  [0402-B]
R111  R0402-B  [0402-B]
R112  R0402-B  [0402-B]
R113  R0402-B  [0402-B]
U4  GTL2002DC  [VSSOP-8]
U5  GTL2002DC  [VSSOP-8]
U25  GTL2002DC  [VSSOP-8]
U26  LD1117S  [SOT-223]
U44  PCA9540BDP  [SOP65P490X110-8N]
U99  IP4251CZ16-8-TTL  [SON40P135X330X55-17N]
U$1  MICRO-SD-2CD  [TF-MICRO-SD_PP2]
X1  PICO-SPOX-5  [PICO-SPOX-5]

### Nets
A_SCL: PB-NW.2 R8.2 U4.5(D2)
A_SCL': R110.2 U4.4(S2) U44.8(SC1)
A_SDA: PB-NW.4 R7.2 U4.6(D1)
A_SDA': R111.2 U4.3(S1) U44.7(SD1)
AB_SCL: U25.4(S2) ; also sheet 1
AB_SCL': R109.2 U25.5(D2) U44.1(SCL)
AB_SDA: U25.3(S1) ; also sheet 1
AB_SDA': R108.2 U25.6(D1) U44.2(SDA)
B_SCL: PB-SE.2 R10.2 U5.5(D2)
B_SCL': R112.2 U5.4(S2) U44.5(SC0)
B_SDA: PB-SE.4 R9.2 U5.6(D1)
B_SDA': R113.2 U5.3(S1) U44.4(SD0)
BETA_5V: X1.4 X1.4A ; also sheet 10
BETA_5V': C83.1 U26.3(IN) ; also sheet 6,7,8,10
CD: U99.1(CH1) U$1.CD1
CLK: U99.6(CH6) U$1.5
CMD: U99.5(CH5) U$1.3
DAT0: U99.7(CH7) U$1.7
DAT1: U99.8(CH8) U$1.8
DAT2: U99.3(CH3) U$1.1
DAT3: U99.4(CH4) U$1.2
E_VE_CV: PB-NW.8
E_VE_OV: PB-NW.9
E_VE_UV: PB-NW.11
GND: C11.2 C12.2 C82.2 C83.2 C84.2 C85.2 C86.2 C87.2 C88.2 PB-NW.6 PB-NW.7 PB-NW.10 PB-NW.13 PB-NW.18 PB-SE.6 PB-SE.7 PB-SE.10 PB-SE.13 PB-SE.18 U4.1(GND) U5.1(GND) U25.1(GND) U26.1(GND) U44.6(VSS) U99.17(EP) U$1.6 U$1.CD2 X1.1 X1.1A X1.5 X1.5A ; also sheet 1,2,3,6,7,8,9,10
M_V_NW: R7.1 R8.1 R11.1 ; also sheet 6,7
M_V_SE: R9.1 R10.1 R12.1 ; also sheet 6,7
N$32: C11.1 R11.2 U4.7(DREF) U4.8(GREF)
N$33: C12.1 R12.2 U5.7(DREF) U5.8(GREF)
N$86: R99.2 U99.16(CH1_2)
N$118: U$1.MT2(MT)
N$124: U$1.MT1(MT)
N$1006: C82.1 R92.2 U25.7(DREF) U25.8(GREF)
N_CHK_V: PB-SE.20
N_VE_CV: PB-SE.12
N_VE_OV: PB-SE.1
N_VE_UV: PB-SE.15
N_VN_CV: PB-SE.14
N_VN_OV: PB-SE.3
N_VN_UV: PB-SE.17
N_VW_CV: PB-SE.16
N_VW_OV: PB-SE.5
N_VW_UV: PB-SE.19
PMOD_D0: U99.9(CH8_2) ZED.101(_PMOD:PMOD_D0)
PMOD_D1: U99.10(CH7_2) ZED.102(_PMOD:PMOD_D1)
PMOD_D2: U99.12(CH5_2) ZED.103(_PMOD:PMOD_D2)
PMOD_D3: U99.11(CH6_2) ZED.104(_PMOD:PMOD_D3)
PMOD_D6: U99.14(CH3_2) ZED.107(_PMOD:PMOD_D6)
PMOD_D7: U99.13(CH4_2) ZED.108(_PMOD:PMOD_D7)
PMOD_SCL: R90.2 ZED.105(_PMOD:PMOD_D4) ; also sheet 6,7,8,9,10
PMOD_SDA: R91.2 ZED.106(_PMOD:PMOD_D5) ; also sheet 6,7,8,9,10
REGOUT: C84.1 L18.1 U26.2(OUT) U26.TER(OUT)
S_CHK_V: PB-NW.20
S_VE_CV: PB-NW.16
S_VE_OV: PB-NW.5
S_VE_UV: PB-NW.19
S_VS_CV: PB-NW.14
S_VS_OV: PB-NW.3
S_VS_UV: PB-NW.17
S_VW_CV: PB-NW.12
S_VW_OV: PB-NW.1
S_VW_UV: PB-NW.15
VCC: C85.1 C86.1 C87.1 C88.1 L18.2 R90.1 R91.1 R92.1 R99.1 R108.1 R109.1 R110.1 R111.1 R112.1 R113.1 U4.2(SREF) U5.2(SREF) U44.3(VDD) U$1.4 ; also sheet 6,7,8,9,10
VCCIO: U25.2(SREF) ; also sheet 9,10
VIN: X1.3 X1.3A
W_VW_CV: PB-SE.8
W_VW_OV: PB-SE.9
W_VW_UV: PB-SE.11
ZED_5V: X1.2 X1.2A ; also sheet 10
Unconnected: U99.2(CH2) U99.15(CH2_2)

### Buses
PMOD_D[0..7]
CMD,CLK,DAT[0..3],CD

### Notes on the sheet
- AXIOM Beta Test
- Level Translation and µSD
- Copyright (C) 2015 H.Poetzl
  Licensed under CERN OHL v.1.2

## Sheet 6 of 10
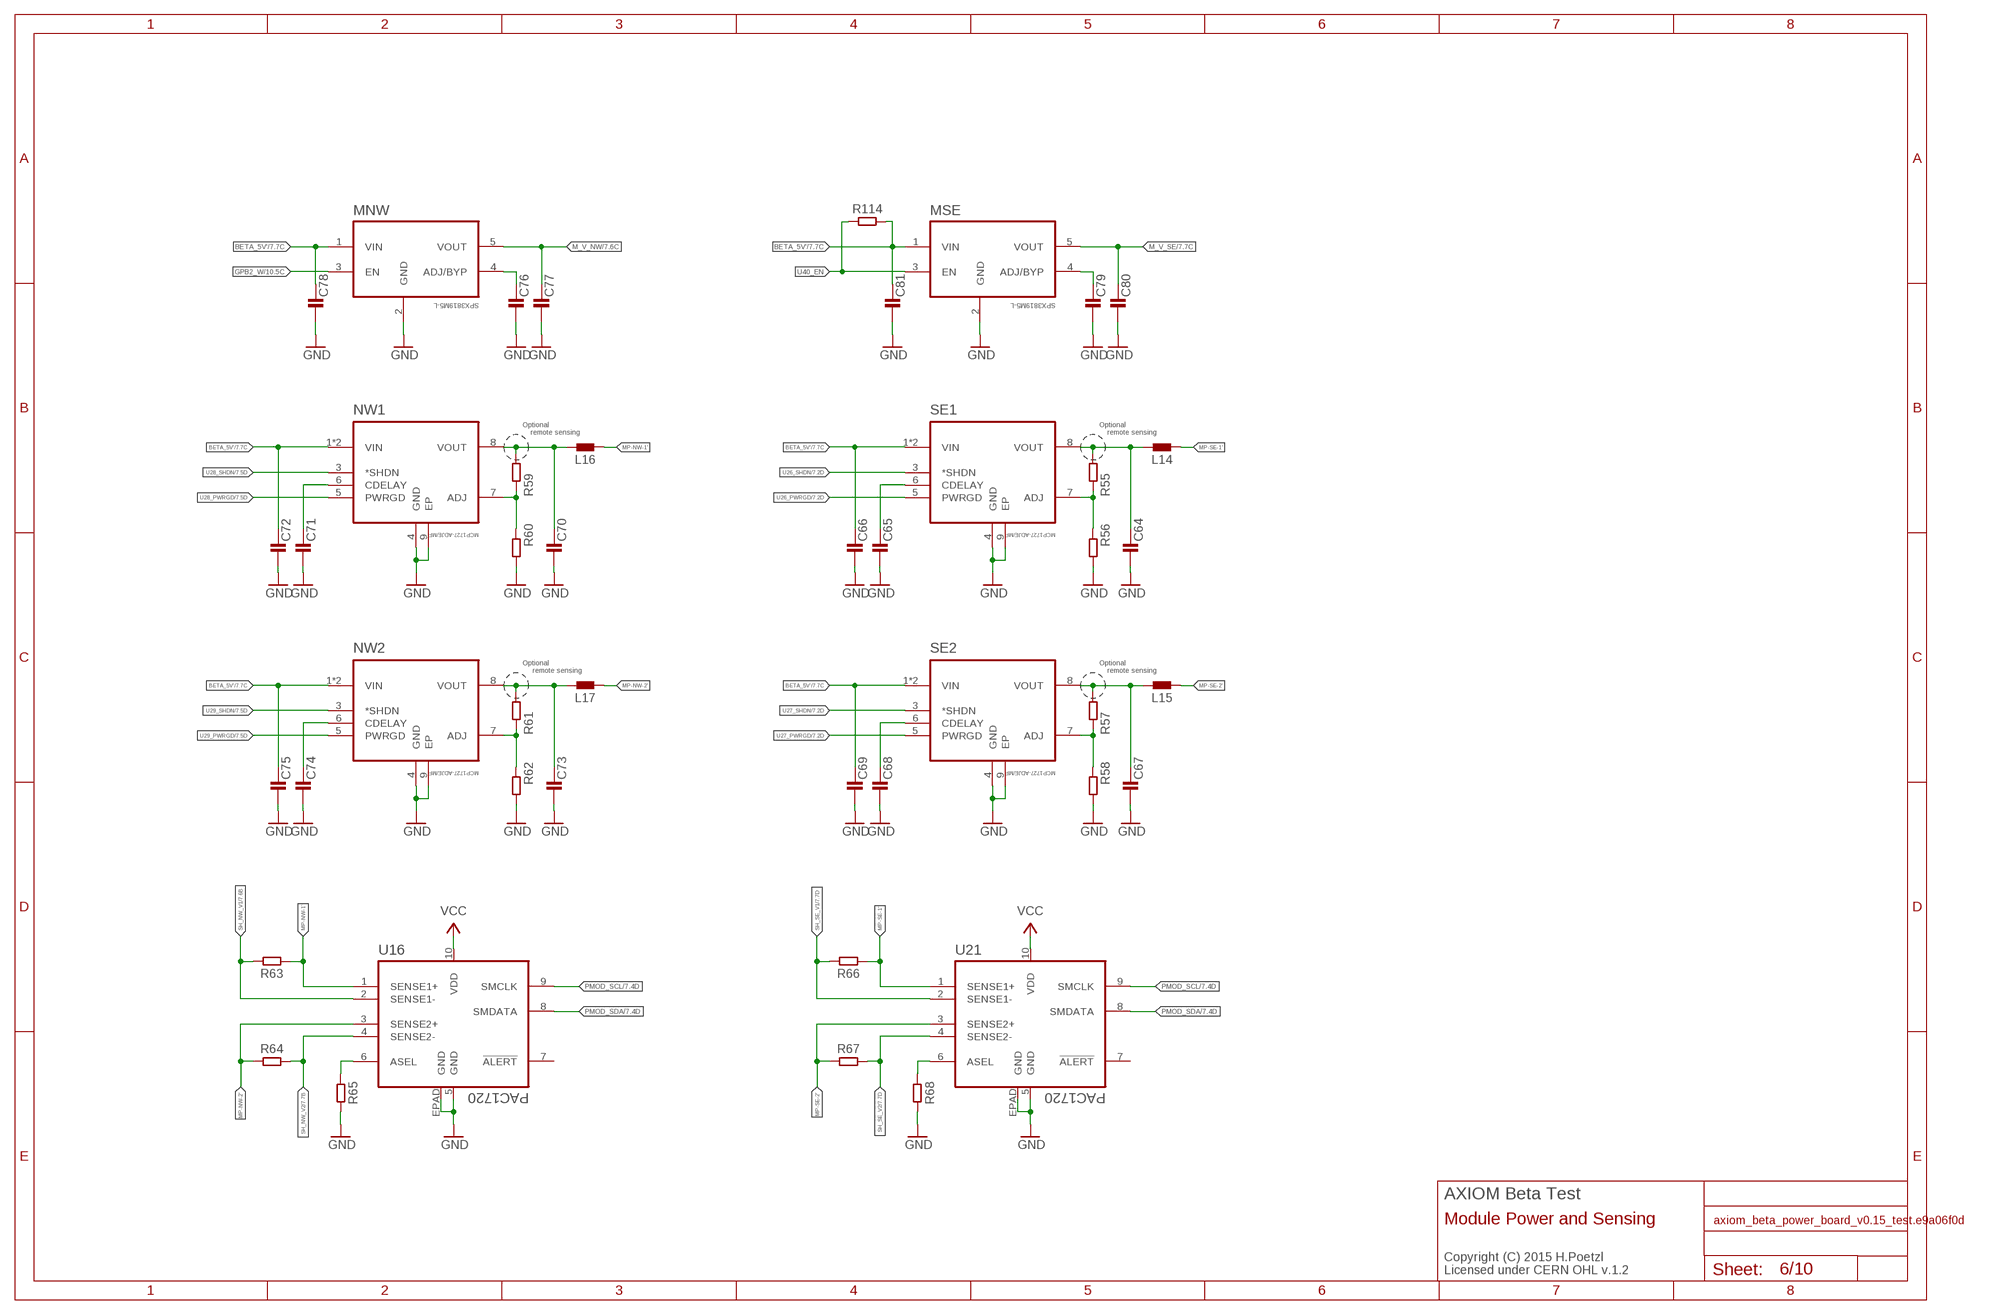
[diagram p5: schematic, sheet 6]

### Parts
C64  C0603-B  [0603-B]
C65  C0402-B  [0402-B]
C66  C0603-B  [0603-B]
C67  C0603-B  [0603-B]
C68  C0402-B  [0402-B]
C69  C0603-B  [0603-B]
C70  C0603-B  [0603-B]
C71  C0402-B  [0402-B]
C72  C0603-B  [0603-B]
C73  C0603-B  [0603-B]
C74  C0402-B  [0402-B]
C75  C0603-B  [0603-B]
C76  C0402-B  [0402-B]
C77  C0402-B  [0402-B]
C78  C0402-B  [0402-B]
C79  C0402-B  [0402-B]
C80  C0402-B  [0402-B]
C81  C0402-B  [0402-B]
L14  L0805-B  [0805-B]
L15  L0805-B  [0805-B]
L16  L0805-B  [0805-B]
L17  L0805-B  [0805-B]
MNW  SPX3819M5-L  [SOT95P280X145-5N]
MSE  SPX3819M5-L  [SOT95P280X145-5N]
NW1  MCP1727-ADJE/MF  [DFN65P300X300X100-9N]
NW2  MCP1727-ADJE/MF  [DFN65P300X300X100-9N]
R55  R0402-B  [0402-B]
R56  R0402-B  [0402-B]
R57  R0402-B  [0402-B]
R58  R0402-B  [0402-B]
R59  R0402-B  [0402-B]
R60  R0402-B  [0402-B]
R61  R0402-B  [0402-B]
R62  R0402-B  [0402-B]
R63  R1206-B  [1206-B]
R64  R1206-B  [1206-B]
R65  R0402-B  [0402-B]
R66  R1206-B  [1206-B]
R67  R1206-B  [1206-B]
R68  R0402-B  [0402-B]
R114  R0402-B  [0402-B]
SE1  MCP1727-ADJE/MF  [DFN65P300X300X100-9N]
SE2  MCP1727-ADJE/MF  [DFN65P300X300X100-9N]
U16  PAC1720  [DFN3X3_10LEAD]
U21  PAC1720  [DFN3X3_10LEAD]

### Nets
BETA_5V': C66.1 C69.1 C72.1 C75.1 C78.1 C81.1 MNW.1(VIN) MSE.1(VIN) NW1.1(VIN) NW1.2(VIN) NW2.1(VIN) NW2.2(VIN) R114.1 SE1.1(VIN) SE1.2(VIN) SE2.1(VIN) SE2.2(VIN) ; also sheet 5,7,8,10
GND: C64.2 C65.2 C66.2 C67.2 C68.2 C69.2 C70.2 C71.2 C72.2 C73.2 C74.2 C75.2 C76.2 C77.2 C78.2 C79.2 C80.2 C81.2 MNW.2(GND) MSE.2(GND) NW1.4(GND) NW1.9(EP) NW2.4(GND) NW2.9(EP) R56.2 R58.2 R60.2 R62.2 R65.2 R68.2 SE1.4(GND) SE1.9(EP) SE2.4(GND) SE2.9(EP) U16.5(GND) U16.EPAD(GND) U21.5(GND) U21.EPAD(GND) ; also sheet 1,2,3,5,7,8,9,10
GPB2_W: MNW.3(EN) ; also sheet 10
M_V_NW: C77.1 MNW.5(VOUT) ; also sheet 5,7
M_V_SE: C80.1 MSE.5(VOUT) ; also sheet 5,7
MP-NW-1': L16.2 R63.1 U16.1(SENSE1+)
MP-NW-2': L17.2 R64.1 U16.3(SENSE2+)
MP-SE-1': L14.2 R66.1 U21.1(SENSE1+)
MP-SE-2': L15.2 R67.1 U21.3(SENSE2+)
N$48: C64.1 L14.1 R55.1 SE1.8(VOUT)
N$49: R55.2 R56.1 SE1.7(ADJ)
N$97: C65.1 SE1.6(CDELAY)
N$98: C67.1 L15.1 R57.1 SE2.8(VOUT)
N$420: R57.2 R58.1 SE2.7(ADJ)
N$421: C68.1 SE2.6(CDELAY)
N$612: C70.1 L16.1 NW1.8(VOUT) R59.1
N$613: NW1.7(ADJ) R59.2 R60.1
N$804: C71.1 NW1.6(CDELAY)
N$805: C73.1 L17.1 NW2.8(VOUT) R61.1
N$996: NW2.7(ADJ) R61.2 R62.1
N$997: C74.1 NW2.6(CDELAY)
N$999: R65.1 U16.6(ASEL)
N$1015: R68.1 U21.6(ASEL)
N$3622: C76.1 MNW.4(ADJ/BYP)
N$7859: C79.1 MSE.4(ADJ/BYP)
PMOD_SCL: U16.9(SMCLK) U21.9(SMCLK) ; also sheet 5,7,8,9,10
PMOD_SDA: U16.8(SMDATA) U21.8(SMDATA) ; also sheet 5,7,8,9,10
SH_NW_V1: R63.2 U16.2(SENSE1-) ; also sheet 7
SH_NW_V2: R64.2 U16.4(SENSE2-) ; also sheet 7
SH_SE_V1: R66.2 U21.2(SENSE1-) ; also sheet 7
SH_SE_V2: R67.2 U21.4(SENSE2-) ; also sheet 7
U26_PWRGD: SE1.5(PWRGD) ; also sheet 7
U26_SHDN: SE1.3(*SHDN) ; also sheet 7
U27_PWRGD: SE2.5(PWRGD) ; also sheet 7
U27_SHDN: SE2.3(*SHDN) ; also sheet 7
U28_PWRGD: NW1.5(PWRGD) ; also sheet 7
U28_SHDN: NW1.3(*SHDN) ; also sheet 7
U29_PWRGD: NW2.5(PWRGD) ; also sheet 7
U29_SHDN: NW2.3(*SHDN) ; also sheet 7
U40_EN: MSE.3(EN) R114.2
VCC: U16.10(VDD) U21.10(VDD) ; also sheet 5,7,8,9,10
Unconnected: U16.7(!ALERT) U21.7(!ALERT)

### Notes on the sheet
- Optional
      remote sensing
- Optional
      remote sensing
- Optional
       remote sensing
- Optional
      remote sensing
- AXIOM Beta Test
- Module Power and Sensing
- Copyright (C) 2015 H.Poetzl
  Licensed under CERN OHL v.1.2

## Sheet 7 of 10
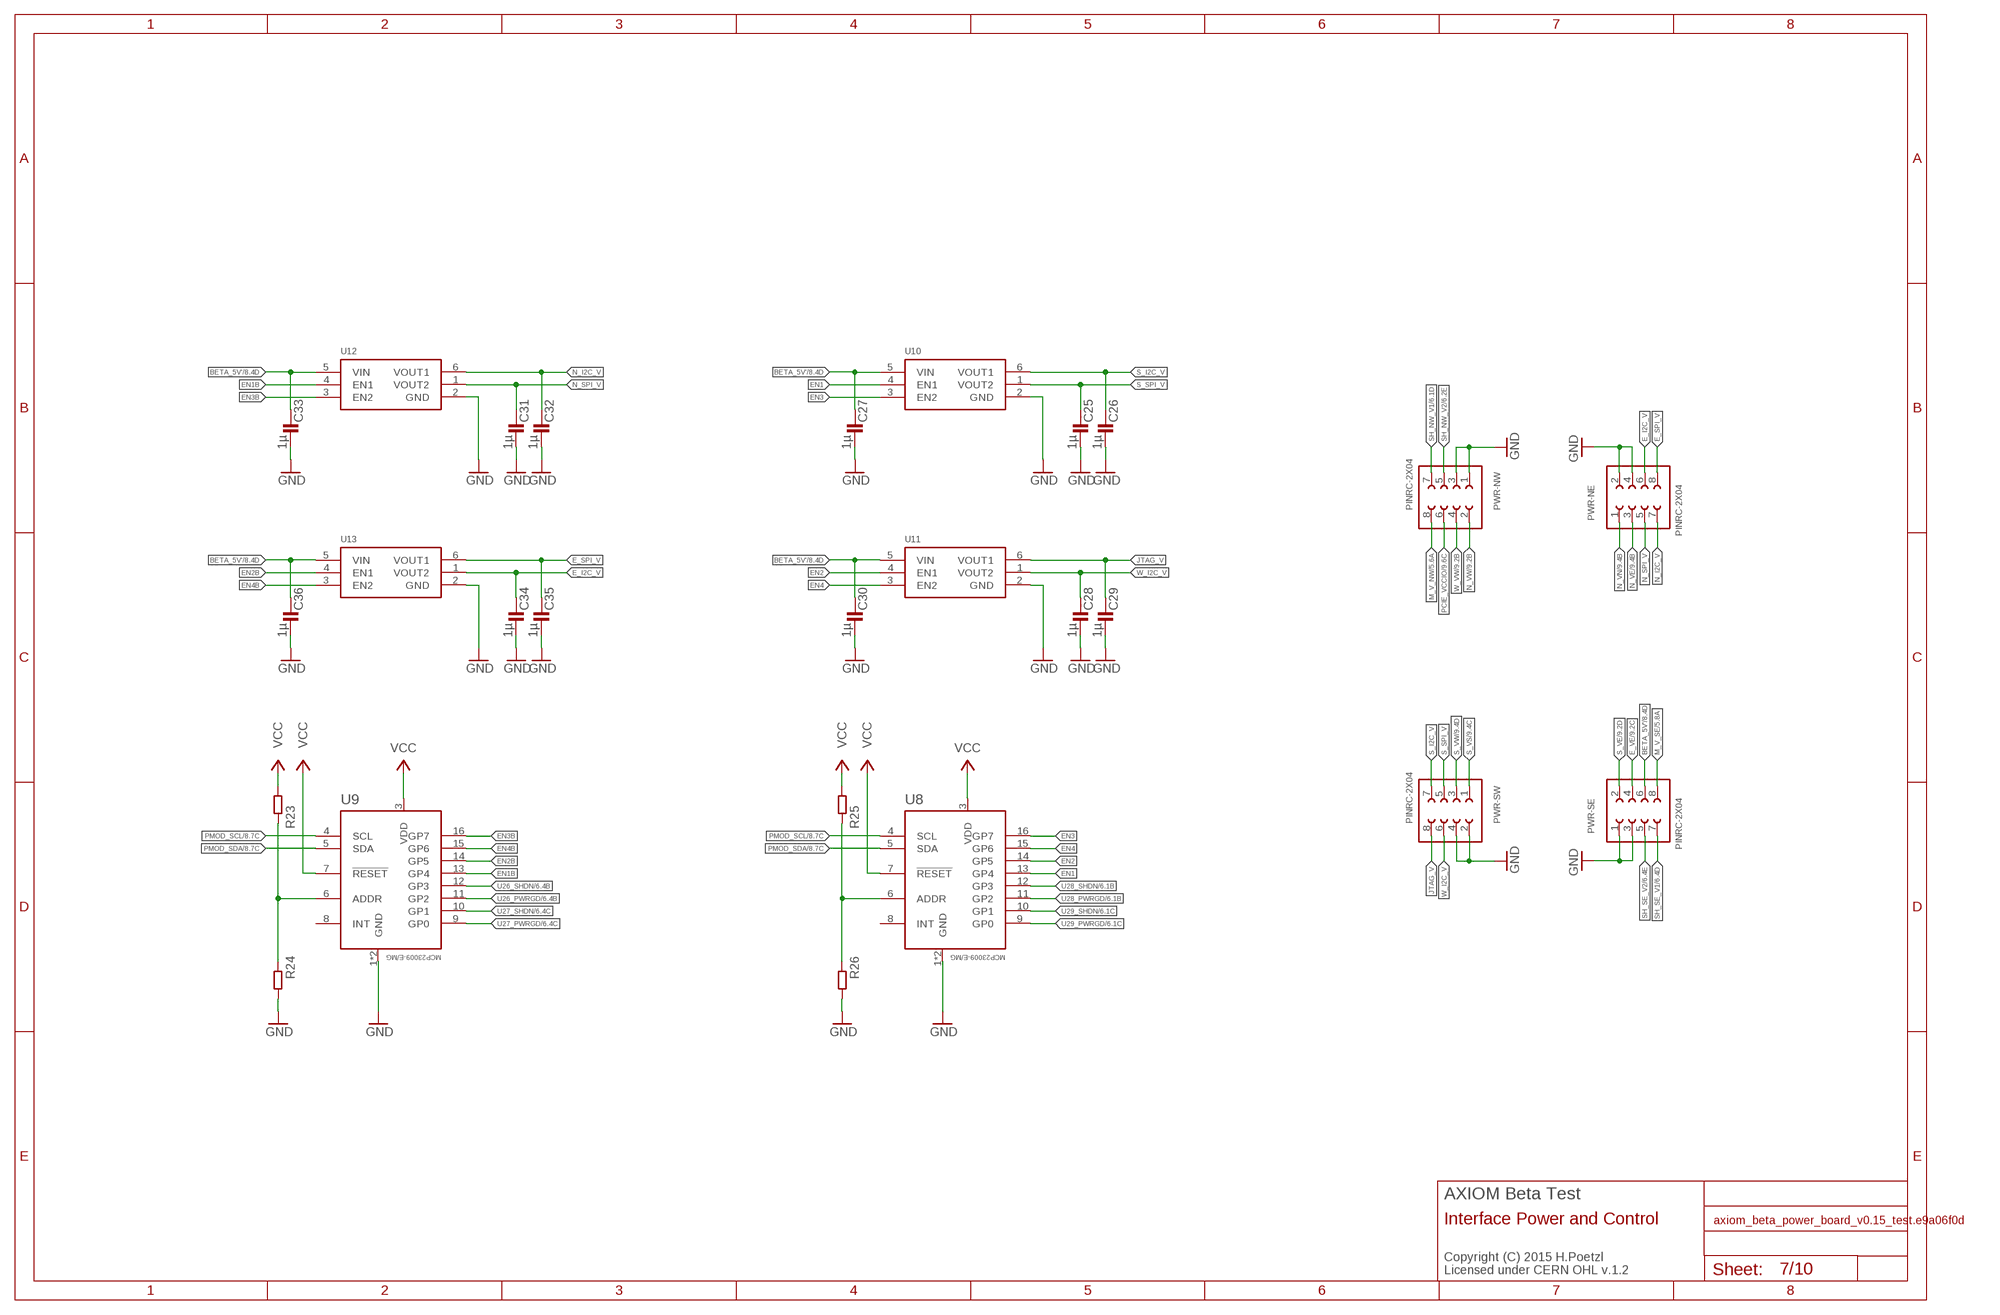
[diagram p6: schematic, sheet 7]

### Parts
C25  1µ  C0402-B  [0402-B]
C26  1µ  C0402-B  [0402-B]
C27  1µ  C0603-B  [0603-B]
C28  1µ  C0402-B  [0402-B]
C29  1µ  C0402-B  [0402-B]
C30  1µ  C0603-B  [0603-B]
C31  1µ  C0402-B  [0402-B]
C32  1µ  C0402-B  [0402-B]
C33  1µ  C0603-B  [0603-B]
C34  1µ  C0402-B  [0402-B]
C35  1µ  C0402-B  [0402-B]
C36  1µ  C0603-B  [0603-B]
PWR-NE  PINRC-2X04  [R2X04]
PWR-NW  PINRC-2X04  [R2X04]
PWR-SE  PINRC-2X04  [R2X04]
PWR-SW  PINRC-2X04  [R2X04]
R23  R0402-B  [0402-B]
R24  R0402-B  [0402-B]
R25  R0402-B  [0402-B]
R26  R0402-B  [0402-B]
U8  MCP23009-E/MG  [QFN50P300X300X80-17N]
U9  MCP23009-E/MG  [QFN50P300X300X80-17N]
U10  LDO_DUAL-AP7312  [SOT23-6]
U11  LDO_DUAL-AP7312  [SOT23-6]
U12  LDO_DUAL-AP7312  [SOT23-6]
U13  LDO_DUAL-AP7312  [SOT23-6]

### Nets
BETA_5V': C27.1 C30.1 C33.1 C36.1 PWR-SE.6 U10.5(VIN) U11.5(VIN) U12.5(VIN) U13.5(VIN) ; also sheet 5,6,8,10
E_I2C_V: C34.1 PWR-NE.6 U13.1(VOUT2)
E_SPI_V: C35.1 PWR-NE.8 U13.6(VOUT1)
E_VE: PWR-SE.4 ; also sheet 9
EN1: U8.13(GP4) U10.4(EN1)
EN1B: U9.13(GP4) U12.4(EN1)
EN2: U8.14(GP5) U11.4(EN1)
EN2B: U9.14(GP5) U13.4(EN1)
EN3: U8.16(GP7) U10.3(EN2)
EN3B: U9.16(GP7) U12.3(EN2)
EN4: U8.15(GP6) U11.3(EN2)
EN4B: U9.15(GP6) U13.3(EN2)
GND: C25.2 C26.2 C27.2 C28.2 C29.2 C30.2 C31.2 C32.2 C33.2 C34.2 C35.2 C36.2 PWR-NE.2 PWR-NE.4 PWR-NW.1 PWR-NW.3 PWR-SE.1 PWR-SE.3 PWR-SW.2 PWR-SW.4 R24.2 R26.2 U8.1(GND) U8.EP(GND) U9.1(GND) U9.EP(GND) U10.2(GND) U11.2(GND) U12.2(GND) U13.2(GND) ; also sheet 1,2,3,5,6,8,9,10
JTAG_V: C29.1 PWR-SW.8 U11.6(VOUT1)
M_V_NW: PWR-NW.8 ; also sheet 5,6
M_V_SE: PWR-SE.8 ; also sheet 5,6
N$244: R23.2 R24.1 U9.6(ADDR)
N$250: R25.2 R26.1 U8.6(ADDR)
N_I2C_V: C32.1 PWR-NE.7 U12.6(VOUT1)
N_SPI_V: C31.1 PWR-NE.5 U12.1(VOUT2)
N_VE: PWR-NE.3 ; also sheet 9
N_VN: PWR-NE.1 ; also sheet 9
N_VW: PWR-NW.2 ; also sheet 9
PCIE_VCCIO: PWR-NW.6 ; also sheet 9
PMOD_SCL: U8.4(SCL) U9.4(SCL) ; also sheet 5,6,8,9,10
PMOD_SDA: U8.5(SDA) U9.5(SDA) ; also sheet 5,6,8,9,10
S_I2C_V: C26.1 PWR-SW.7 U10.6(VOUT1)
S_SPI_V: C25.1 PWR-SW.5 U10.1(VOUT2)
S_VE: PWR-SE.2 ; also sheet 9
S_VS: PWR-SW.1 ; also sheet 9
S_VW: PWR-SW.3 ; also sheet 9
SH_NW_V1: PWR-NW.7 ; also sheet 6
SH_NW_V2: PWR-NW.5 ; also sheet 6
SH_SE_V1: PWR-SE.7 ; also sheet 6
SH_SE_V2: PWR-SE.5 ; also sheet 6
U26_PWRGD: U9.11(GP2) ; also sheet 6
U26_SHDN: U9.12(GP3) ; also sheet 6
U27_PWRGD: U9.9(GP0) ; also sheet 6
U27_SHDN: U9.10(GP1) ; also sheet 6
U28_PWRGD: U8.11(GP2) ; also sheet 6
U28_SHDN: U8.12(GP3) ; also sheet 6
U29_PWRGD: U8.9(GP0) ; also sheet 6
U29_SHDN: U8.10(GP1) ; also sheet 6
VCC: R23.1 R25.1 U8.3(VDD) U8.7(!RESET) U9.3(VDD) U9.7(!RESET) ; also sheet 5,6,8,9,10
W_I2C_V: C28.1 PWR-SW.6 U11.1(VOUT2)
W_VW: PWR-NW.4 ; also sheet 9
Unconnected: U8.8(INT) U9.8(INT)

### Notes on the sheet
- AXIOM Beta Test
- Interface Power and Control
- Copyright (C) 2015 H.Poetzl
  Licensed under CERN OHL v.1.2

## Sheet 8 of 10
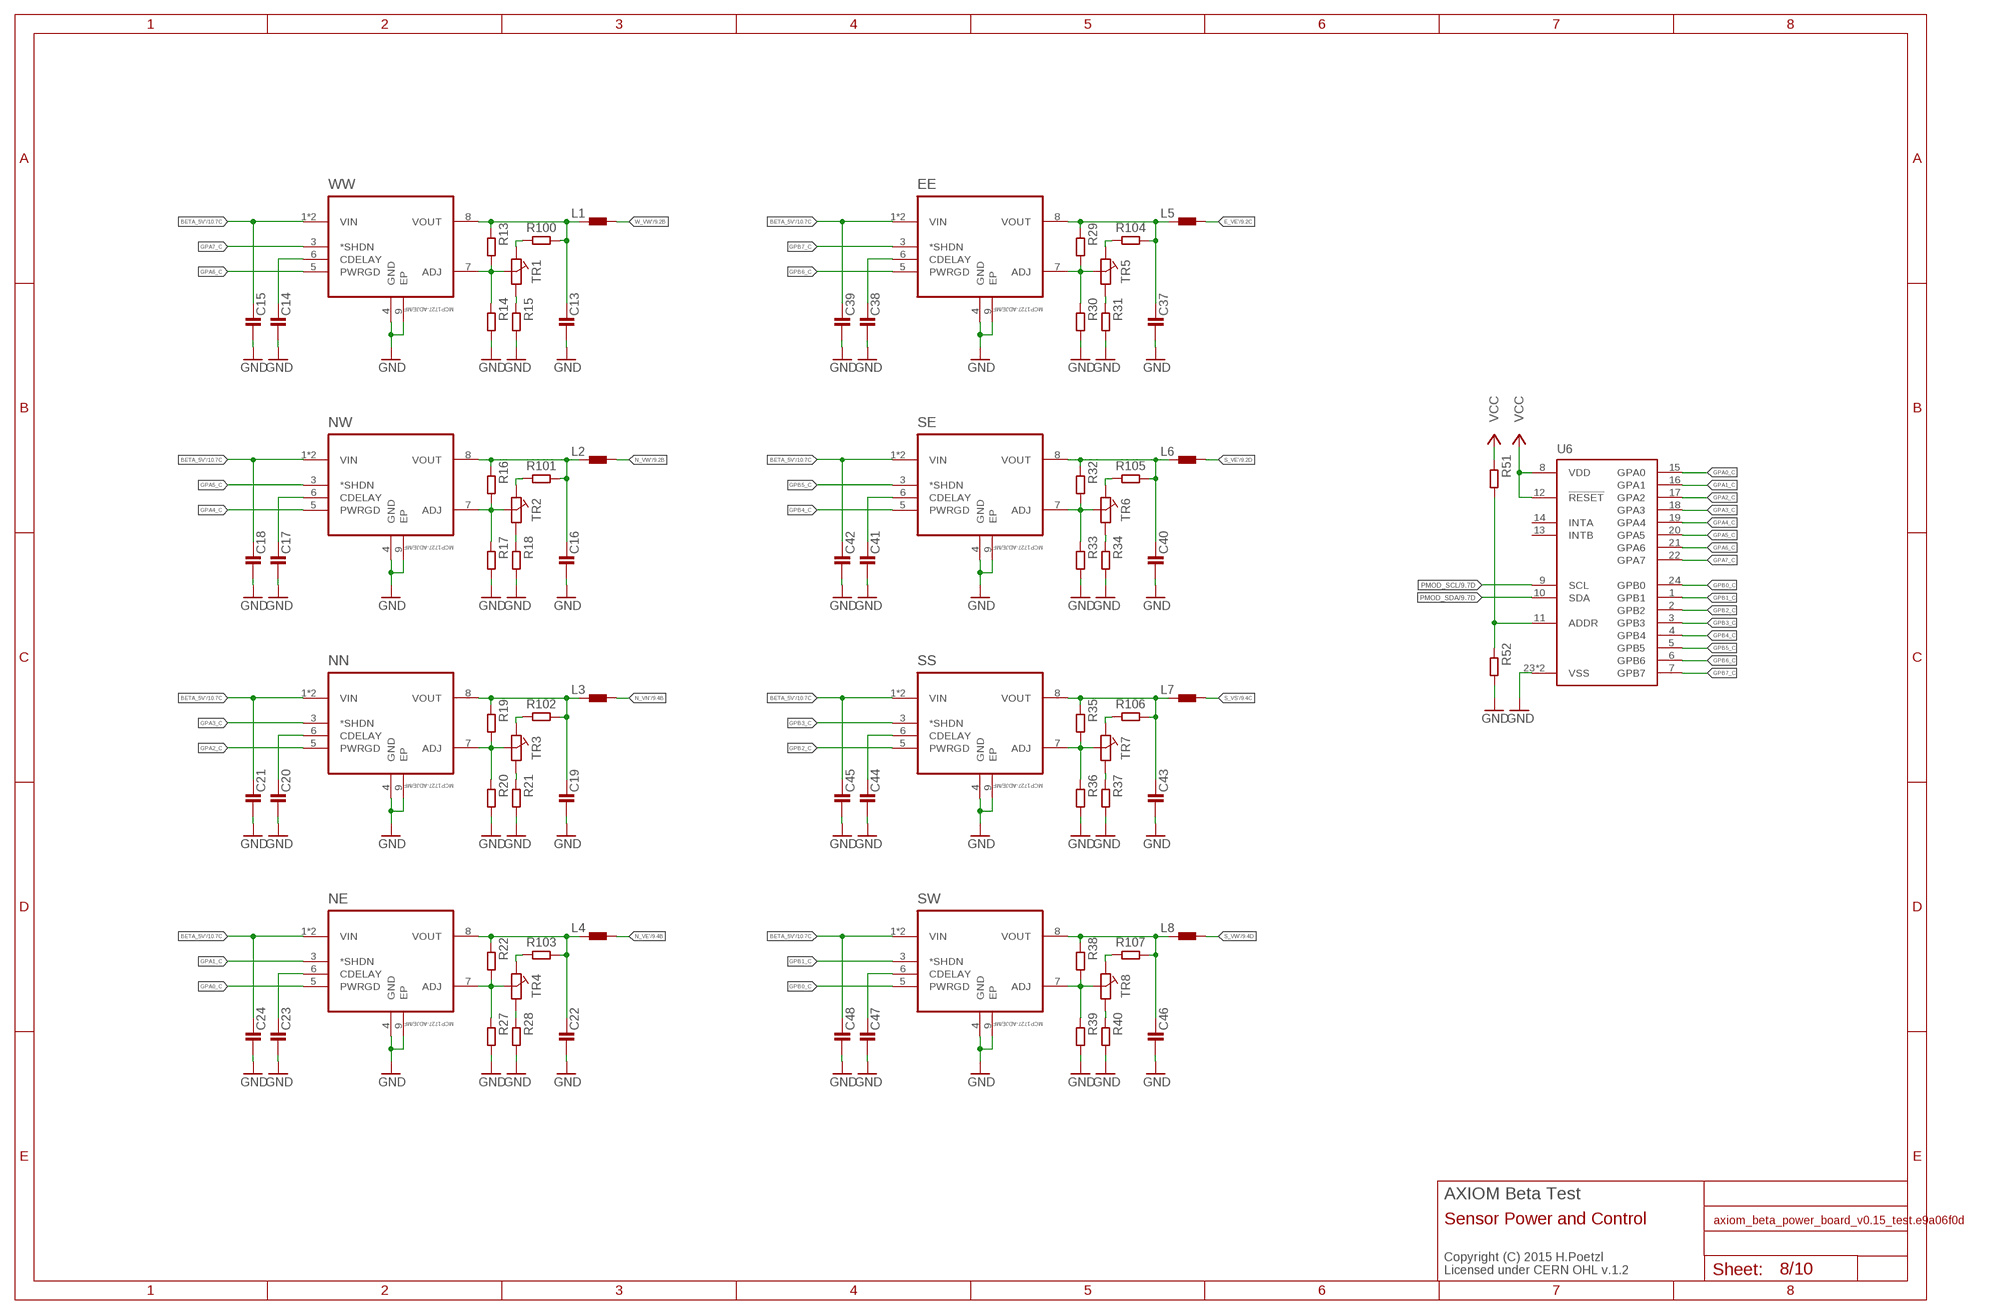
[diagram p7: schematic, sheet 8]

### Parts
C13  C0603-B  [0603-B]
C14  C0402-B  [0402-B]
C15  C0603-B  [0603-B]
C16  C0603-B  [0603-B]
C17  C0402-B  [0402-B]
C18  C0603-B  [0603-B]
C19  C0603-B  [0603-B]
C20  C0402-B  [0402-B]
C21  C0603-B  [0603-B]
C22  C0603-B  [0603-B]
C23  C0402-B  [0402-B]
C24  C0603-B  [0603-B]
C37  C0603-B  [0603-B]
C38  C0402-B  [0402-B]
C39  C0603-B  [0603-B]
C40  C0603-B  [0603-B]
C41  C0402-B  [0402-B]
C42  C0603-B  [0603-B]
C43  C0603-B  [0603-B]
C44  C0402-B  [0402-B]
C45  C0603-B  [0603-B]
C46  C0603-B  [0603-B]
C47  C0402-B  [0402-B]
C48  C0603-B  [0603-B]
EE  MCP1727-ADJE/MF  [DFN65P300X300X100-9N]
L1  L0805-B  [0805-B]
L2  L0805-B  [0805-B]
L3  L0805-B  [0805-B]
L4  L0805-B  [0805-B]
L5  L0805-B  [0805-B]
L6  L0805-B  [0805-B]
L7  L0805-B  [0805-B]
L8  L0805-B  [0805-B]
NE  MCP1727-ADJE/MF  [DFN65P300X300X100-9N]
NN  MCP1727-ADJE/MF  [DFN65P300X300X100-9N]
NW  MCP1727-ADJE/MF  [DFN65P300X300X100-9N]
R13  R0402-B  [0402-B]
R14  R0402-B  [0402-B]
R15  R0402-B  [0402-B]
R16  R0402-B  [0402-B]
R17  R0402-B  [0402-B]
R18  R0402-B  [0402-B]
R19  R0402-B  [0402-B]
R20  R0402-B  [0402-B]
R21  R0402-B  [0402-B]
R22  R0402-B  [0402-B]
R27  R0402-B  [0402-B]
R28  R0402-B  [0402-B]
R29  R0402-B  [0402-B]
R30  R0402-B  [0402-B]
R31  R0402-B  [0402-B]
R32  R0402-B  [0402-B]
R33  R0402-B  [0402-B]
R34  R0402-B  [0402-B]
R35  R0402-B  [0402-B]
R36  R0402-B  [0402-B]
R37  R0402-B  [0402-B]
R38  R0402-B  [0402-B]
R39  R0402-B  [0402-B]
R40  R0402-B  [0402-B]
R51  R0402-B  [0402-B]
R52  R0402-B  [0402-B]
R100  R0402-B  [0402-B]
R101  R0402-B  [0402-B]
R102  R0402-B  [0402-B]
R103  R0402-B  [0402-B]
R104  R0402-B  [0402-B]
R105  R0402-B  [0402-B]
R106  R0402-B  [0402-B]
R107  R0402-B  [0402-B]
SE  MCP1727-ADJE/MF  [DFN65P300X300X100-9N]
SS  MCP1727-ADJE/MF  [DFN65P300X300X100-9N]
SW  MCP1727-ADJE/MF  [DFN65P300X300X100-9N]
TR1  PVZ2A  [TRIM-PVZ2A]
TR2  PVZ2A  [TRIM-PVZ2A]
TR3  PVZ2A  [TRIM-PVZ2A]
TR4  PVZ2A  [TRIM-PVZ2A]
TR5  PVZ2A  [TRIM-PVZ2A]
TR6  PVZ2A  [TRIM-PVZ2A]
TR7  PVZ2A  [TRIM-PVZ2A]
TR8  PVZ2A  [TRIM-PVZ2A]
U6  MCP23018QFN  [QFN50P400X400X80-25N]
WW  MCP1727-ADJE/MF  [DFN65P300X300X100-9N]

### Nets
BETA_5V': C15.1 C18.1 C21.1 C24.1 C39.1 C42.1 C45.1 C48.1 EE.1(VIN) EE.2(VIN) NE.1(VIN) NE.2(VIN) NN.1(VIN) NN.2(VIN) NW.1(VIN) NW.2(VIN) SE.1(VIN) SE.2(VIN) SS.1(VIN) SS.2(VIN) SW.1(VIN) SW.2(VIN) WW.1(VIN) WW.2(VIN) ; also sheet 5,6,7,10
E_VE': L5.2 ; also sheet 9
GND: C13.2 C14.2 C15.2 C16.2 C17.2 C18.2 C19.2 C20.2 C21.2 C22.2 C23.2 C24.2 C37.2 C38.2 C39.2 C40.2 C41.2 C42.2 C43.2 C44.2 C45.2 C46.2 C47.2 C48.2 EE.4(GND) EE.9(EP) NE.4(GND) NE.9(EP) NN.4(GND) NN.9(EP) NW.4(GND) NW.9(EP) R14.2 R15.2 R17.2 R18.2 R20.2 R21.2 R27.2 R28.2 R30.2 R31.2 R33.2 R34.2 R36.2 R37.2 R39.2 R40.2 R52.2 SE.4(GND) SE.9(EP) SS.4(GND) SS.9(EP) SW.4(GND) SW.9(EP) U6.23(VSS) U6.25(VSS) WW.4(GND) WW.9(EP) ; also sheet 1,2,3,5,6,7,9,10
GPA0_C: NE.5(PWRGD) U6.15(GPA0)
GPA1_C: NE.3(*SHDN) U6.16(GPA1)
GPA2_C: NN.5(PWRGD) U6.17(GPA2)
GPA3_C: NN.3(*SHDN) U6.18(GPA3)
GPA4_C: NW.5(PWRGD) U6.19(GPA4)
GPA5_C: NW.3(*SHDN) U6.20(GPA5)
GPA6_C: U6.21(GPA6) WW.5(PWRGD)
GPA7_C: U6.22(GPA7) WW.3(*SHDN)
GPB0_C: SW.5(PWRGD) U6.24(GPB0)
GPB1_C: SW.3(*SHDN) U6.1(GPB1)
GPB2_C: SS.5(PWRGD) U6.2(GPB2)
GPB3_C: SS.3(*SHDN) U6.3(GPB3)
GPB4_C: SE.5(PWRGD) U6.4(GPB4)
GPB5_C: SE.3(*SHDN) U6.5(GPB5)
GPB6_C: EE.5(PWRGD) U6.6(GPB6)
GPB7_C: EE.3(*SHDN) U6.7(GPB7)
N$34: C13.1 L1.1 R13.1 R100.2 WW.8(VOUT)
N$39: R13.2 R14.1 TR1.2(B) WW.7(ADJ)
N$41: R15.1 TR1.1(A)
N$88: C14.1 WW.6(CDELAY)
N$253: R100.1 TR1.3(C)
N$416: C16.1 L2.1 NW.8(VOUT) R16.1 R101.2
N$417: NW.7(ADJ) R16.2 R17.1 TR2.2(B)
N$418: R18.1 TR2.1(A)
N$419: C17.1 NW.6(CDELAY)
N$608: C19.1 L3.1 NN.8(VOUT) R19.1 R102.2
N$609: NN.7(ADJ) R19.2 R20.1 TR3.2(B)
N$610: R101.1 TR2.3(C)
N$611: C20.1 NN.6(CDELAY)
N$800: C22.1 L4.1 NE.8(VOUT) R22.1 R103.2
N$801: NE.7(ADJ) R22.2 R27.1 TR4.2(B)
N$802: R21.1 TR3.1(A)
N$803: C23.1 NE.6(CDELAY)
N$992: C37.1 EE.8(VOUT) L5.1 R29.1 R104.2
N$993: EE.7(ADJ) R29.2 R30.1 TR5.2(B)
N$994: R102.1 TR3.3(C)
N$995: C38.1 EE.6(CDELAY)
N$998: R28.1 TR4.1(A)
N$1000: C40.1 L6.1 R32.1 R105.2 SE.8(VOUT)
N$1001: R32.2 R33.1 SE.7(ADJ) TR6.2(B)
N$1002: R103.1 TR4.3(C)
N$1003: C41.1 SE.6(CDELAY)
N$1007: R31.1 TR5.1(A)
N$1008: C43.1 L7.1 R35.1 R106.2 SS.8(VOUT)
N$1009: R35.2 R36.1 SS.7(ADJ) TR7.2(B)
N$1010: R104.1 TR5.3(C)
N$1011: C44.1 SS.6(CDELAY)
N$1014: R34.1 TR6.1(A)
N$1016: C46.1 L8.1 R38.1 R107.2 SW.8(VOUT)
N$1017: R38.2 R39.1 SW.7(ADJ) TR8.2(B)
N$1018: R105.1 TR6.3(C)
N$1019: C47.1 SW.6(CDELAY)
N$1022: R37.1 TR7.1(A)
N$1944: R106.1 TR7.3(C)
N$3239: R40.1 TR8.1(A)
N$3430: R107.1 TR8.3(C)
N$4020: R51.2 R52.1 U6.11(ADDR)
N_VE': L4.2 ; also sheet 9
N_VN': L3.2 ; also sheet 9
N_VW': L2.2 ; also sheet 9
PMOD_SCL: U6.9(SCL) ; also sheet 5,6,7,9,10
PMOD_SDA: U6.10(SDA) ; also sheet 5,6,7,9,10
S_VE': L6.2 ; also sheet 9
S_VS': L7.2 ; also sheet 9
S_VW': L8.2 ; also sheet 9
VCC: R51.1 U6.8(VDD) U6.12(!RESET) ; also sheet 5,6,7,9,10
W_VW': L1.2 ; also sheet 9
Unconnected: U6.13(INTB) U6.14(INTA)

### Notes on the sheet
- AXIOM Beta Test
- Sensor Power and Control
- Copyright (C) 2015 H.Poetzl
  Licensed under CERN OHL v.1.2

## Sheet 9 of 10
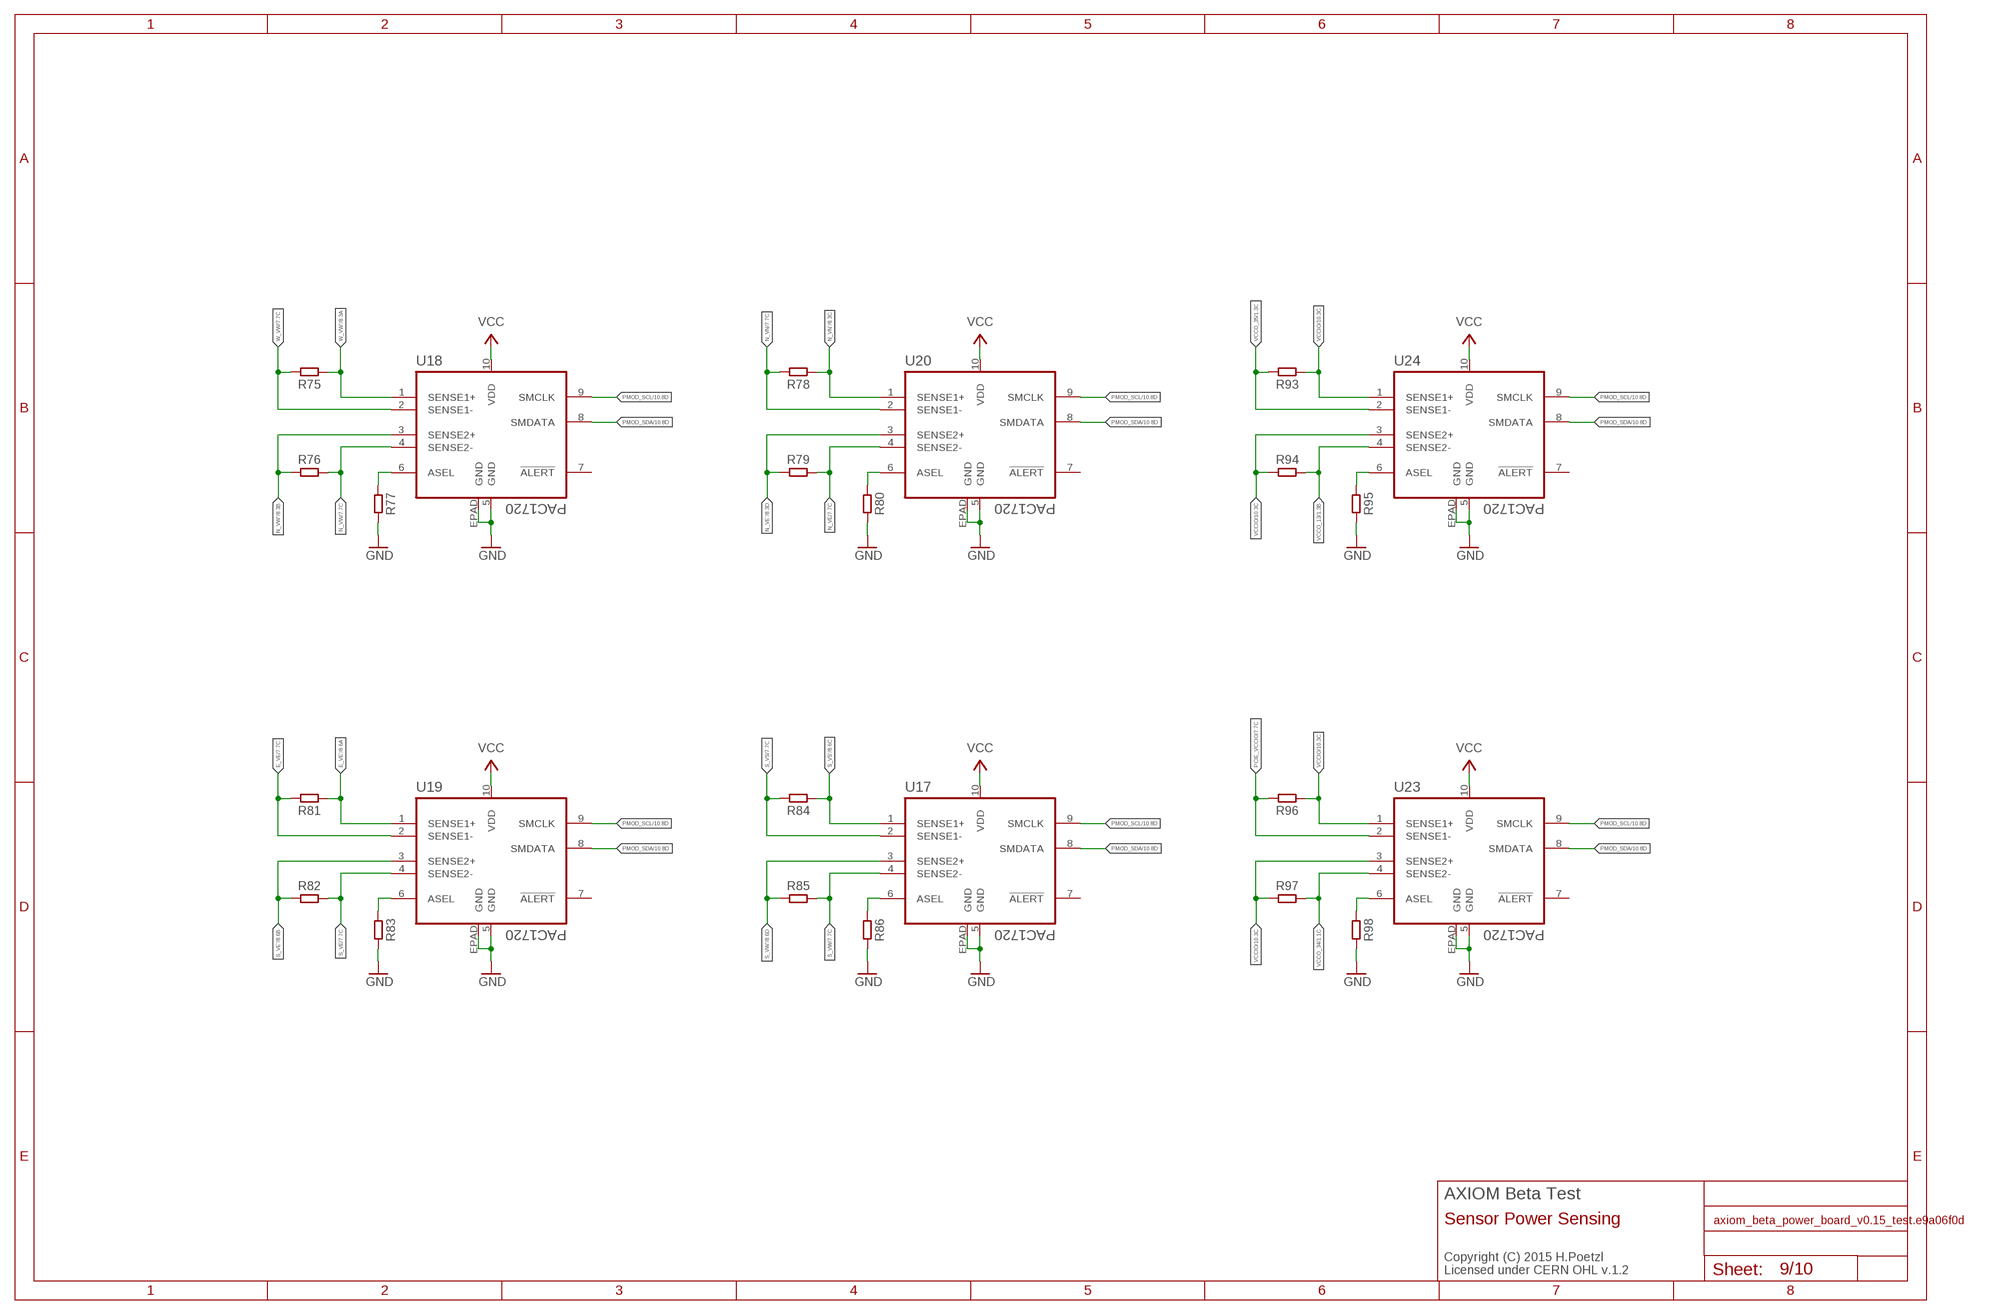
[diagram p8: schematic, sheet 9]

### Parts
R75  R1206-B  [1206-B]
R76  R1206-B  [1206-B]
R77  R0402-B  [0402-B]
R78  R1206-B  [1206-B]
R79  R1206-B  [1206-B]
R80  R0402-B  [0402-B]
R81  R1206-B  [1206-B]
R82  R1206-B  [1206-B]
R83  R0402-B  [0402-B]
R84  R1206-B  [1206-B]
R85  R1206-B  [1206-B]
R86  R0402-B  [0402-B]
R93  R1206-B  [1206-B]
R94  R1206-B  [1206-B]
R95  R0402-B  [0402-B]
R96  R1206-B  [1206-B]
R97  R1206-B  [1206-B]
R98  R0402-B  [0402-B]
U17  PAC1720  [DFN3X3_10LEAD]
U18  PAC1720  [DFN3X3_10LEAD]
U19  PAC1720  [DFN3X3_10LEAD]
U20  PAC1720  [DFN3X3_10LEAD]
U23  PAC1720  [DFN3X3_10LEAD]
U24  PAC1720  [DFN3X3_10LEAD]

### Nets
E_VE: R81.2 U19.2(SENSE1-) ; also sheet 7
E_VE': R81.1 U19.1(SENSE1+) ; also sheet 8
GND: R77.2 R80.2 R83.2 R86.2 R95.2 R98.2 U17.5(GND) U17.EPAD(GND) U18.5(GND) U18.EPAD(GND) U19.5(GND) U19.EPAD(GND) U20.5(GND) U20.EPAD(GND) U23.5(GND) U23.EPAD(GND) U24.5(GND) U24.EPAD(GND) ; also sheet 1,2,3,5,6,7,8,10
N$10: R77.1 U18.6(ASEL)
N$38: R95.1 U24.6(ASEL)
N$76: R98.1 U23.6(ASEL)
N$423: R80.1 U20.6(ASEL)
N$615: R83.1 U19.6(ASEL)
N$807: R86.1 U17.6(ASEL)
N_VE: R79.2 U20.4(SENSE2-) ; also sheet 7
N_VE': R79.1 U20.3(SENSE2+) ; also sheet 8
N_VN: R78.2 U20.2(SENSE1-) ; also sheet 7
N_VN': R78.1 U20.1(SENSE1+) ; also sheet 8
N_VW: R76.2 U18.4(SENSE2-) ; also sheet 7
N_VW': R76.1 U18.3(SENSE2+) ; also sheet 8
PCIE_VCCIO: R96.2 U23.2(SENSE1-) ; also sheet 7
PMOD_SCL: U17.9(SMCLK) U18.9(SMCLK) U19.9(SMCLK) U20.9(SMCLK) U23.9(SMCLK) U24.9(SMCLK) ; also sheet 5,6,7,8,10
PMOD_SDA: U17.8(SMDATA) U18.8(SMDATA) U19.8(SMDATA) U20.8(SMDATA) U23.8(SMDATA) U24.8(SMDATA) ; also sheet 5,6,7,8,10
S_VE: R82.2 U19.4(SENSE2-) ; also sheet 7
S_VE': R82.1 U19.3(SENSE2+) ; also sheet 8
S_VS: R84.2 U17.2(SENSE1-) ; also sheet 7
S_VS': R84.1 U17.1(SENSE1+) ; also sheet 8
S_VW: R85.2 U17.4(SENSE2-) ; also sheet 7
S_VW': R85.1 U17.3(SENSE2+) ; also sheet 8
VCC: U17.10(VDD) U18.10(VDD) U19.10(VDD) U20.10(VDD) U23.10(VDD) U24.10(VDD) ; also sheet 5,6,7,8,10
VCCIO: R93.1 R94.1 R96.1 R97.1 U23.1(SENSE1+) U23.3(SENSE2+) U24.1(SENSE1+) U24.3(SENSE2+) ; also sheet 5,10
VCCO_13 [LVDS]: R94.2 U24.4(SENSE2-) ; also sheet 1
VCCO_34: R97.2 U23.4(SENSE2-) ; also sheet 1
VCCO_35: R93.2 U24.2(SENSE1-) ; also sheet 1
W_VW: R75.2 U18.2(SENSE1-) ; also sheet 7
W_VW': R75.1 U18.1(SENSE1+) ; also sheet 8
Unconnected: U17.7(!ALERT) U18.7(!ALERT) U19.7(!ALERT) U20.7(!ALERT) U23.7(!ALERT) U24.7(!ALERT)

### Notes on the sheet
- AXIOM Beta Test
- Sensor Power Sensing
- Copyright (C) 2015 H.Poetzl
  Licensed under CERN OHL v.1.2

## Sheet 10 of 10
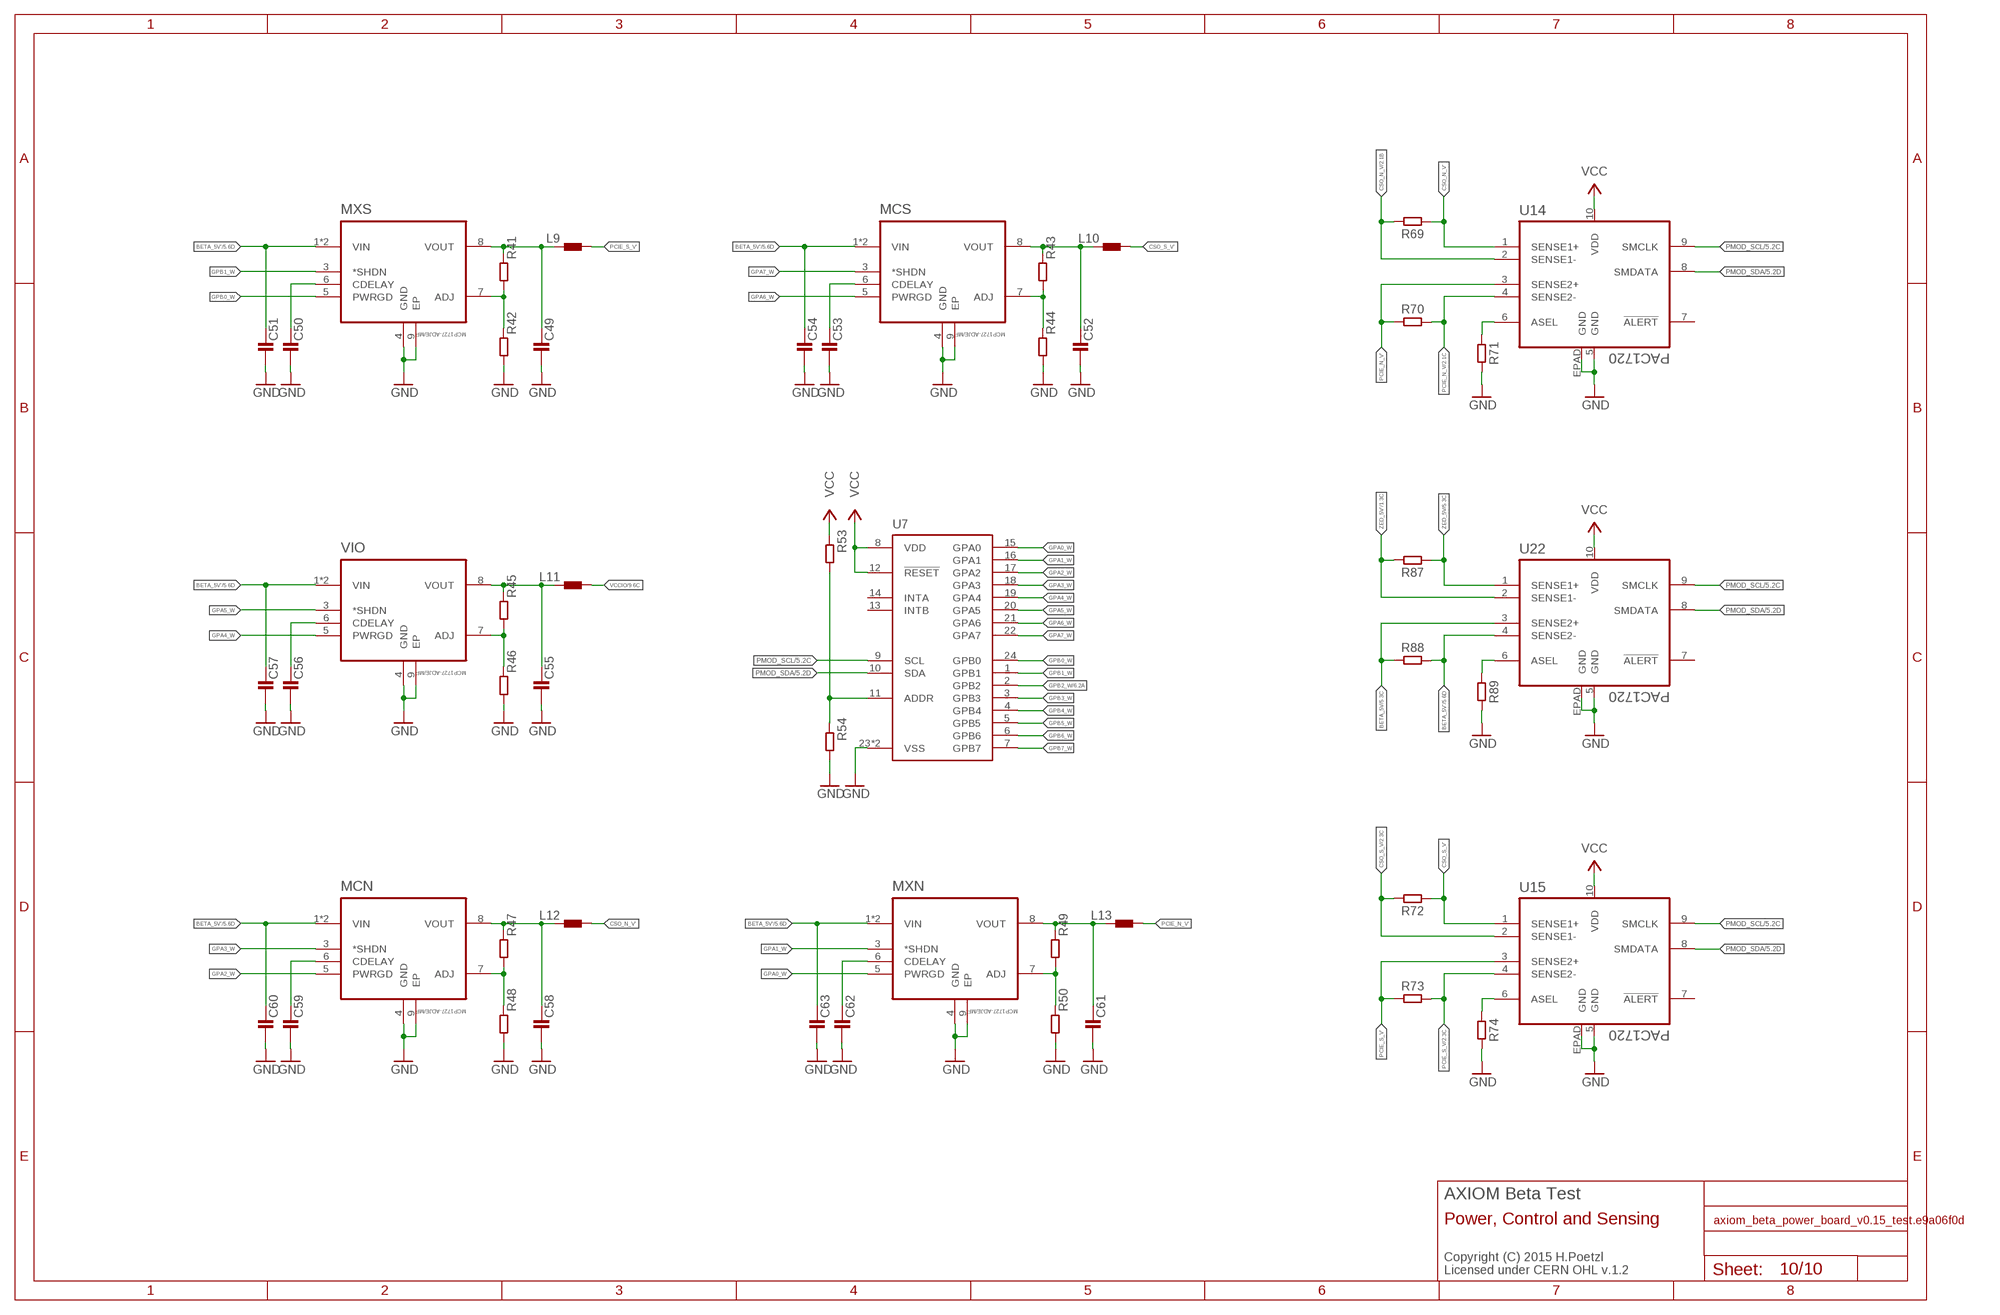
[diagram p9: schematic, sheet 10]

### Parts
C49  C0603-B  [0603-B]
C50  C0402-B  [0402-B]
C51  C0603-B  [0603-B]
C52  C0603-B  [0603-B]
C53  C0402-B  [0402-B]
C54  C0603-B  [0603-B]
C55  C0603-B  [0603-B]
C56  C0402-B  [0402-B]
C57  C0603-B  [0603-B]
C58  C0603-B  [0603-B]
C59  C0402-B  [0402-B]
C60  C0603-B  [0603-B]
C61  C0603-B  [0603-B]
C62  C0402-B  [0402-B]
C63  C0603-B  [0603-B]
L9  L0805-A  [0805-A]
L10  L0805-A  [0805-A]
L11  L0805-A  [0805-A]
L12  L0805-A  [0805-A]
L13  L0805-A  [0805-A]
MCN  MCP1727-ADJE/MF  [DFN65P300X300X100-9N]
MCS  MCP1727-ADJE/MF  [DFN65P300X300X100-9N]
MXN  MCP1727-ADJE/MF  [DFN65P300X300X100-9N]
MXS  MCP1727-ADJE/MF  [DFN65P300X300X100-9N]
R41  R0402-B  [0402-B]
R42  R0402-B  [0402-B]
R43  R0402-B  [0402-B]
R44  R0402-B  [0402-B]
R45  R0402-B  [0402-B]
R46  R0402-B  [0402-B]
R47  R0402-B  [0402-B]
R48  R0402-B  [0402-B]
R49  R0402-B  [0402-B]
R50  R0402-B  [0402-B]
R53  R0402-B  [0402-B]
R54  R0402-B  [0402-B]
R69  R1206-B  [1206-B]
R70  R1206-B  [1206-B]
R71  R0402-B  [0402-B]
R72  R1206-B  [1206-B]
R73  R1206-B  [1206-B]
R74  R0402-B  [0402-B]
R87  R1206-B  [1206-B]
R88  R1206-B  [1206-B]
R89  R0402-B  [0402-B]
U7  MCP23018QFN  [QFN50P400X400X80-25N]
U14  PAC1720  [DFN3X3_10LEAD]
U15  PAC1720  [DFN3X3_10LEAD]
U22  PAC1720  [DFN3X3_10LEAD]
VIO  MCP1727-ADJE/MF  [DFN65P300X300X100-9N]

### Nets
BETA_5V: R88.1 U22.3(SENSE2+) ; also sheet 5
BETA_5V': C51.1 C54.1 C57.1 C60.1 C63.1 MCN.1(VIN) MCN.2(VIN) MCS.1(VIN) MCS.2(VIN) MXN.1(VIN) MXN.2(VIN) MXS.1(VIN) MXS.2(VIN) R88.2 U22.4(SENSE2-) VIO.1(VIN) VIO.2(VIN) ; also sheet 5,6,7,8
CSO_N_V: R69.2 U14.2(SENSE1-) ; also sheet 2
CSO_N_V': L12.2 R69.1 U14.1(SENSE1+)
CSO_S_V: R72.2 U15.2(SENSE1-) ; also sheet 2
CSO_S_V': L10.2 R72.1 U15.1(SENSE1+)
GND: C49.2 C50.2 C51.2 C52.2 C53.2 C54.2 C55.2 C56.2 C57.2 C58.2 C59.2 C60.2 C61.2 C62.2 C63.2 MCN.4(GND) MCN.9(EP) MCS.4(GND) MCS.9(EP) MXN.4(GND) MXN.9(EP) MXS.4(GND) MXS.9(EP) R42.2 R44.2 R46.2 R48.2 R50.2 R54.2 R71.2 R74.2 R89.2 U7.23(VSS) U7.25(VSS) U14.5(GND) U14.EPAD(GND) U15.5(GND) U15.EPAD(GND) U22.5(GND) U22.EPAD(GND) VIO.4(GND) VIO.9(EP) ; also sheet 1,2,3,5,6,7,8,9
GPA0_W: MXN.5(PWRGD) U7.15(GPA0)
GPA1_W: MXN.3(*SHDN) U7.16(GPA1)
GPA2_W: MCN.5(PWRGD) U7.17(GPA2)
GPA3_W: MCN.3(*SHDN) U7.18(GPA3)
GPA4_W: U7.19(GPA4) VIO.5(PWRGD)
GPA5_W: U7.20(GPA5) VIO.3(*SHDN)
GPA6_W: MCS.5(PWRGD) U7.21(GPA6)
GPA7_W: MCS.3(*SHDN) U7.22(GPA7)
GPB0_W: MXS.5(PWRGD) U7.24(GPB0)
GPB1_W: MXS.3(*SHDN) U7.1(GPB1)
GPB2_W: U7.2(GPB2) ; also sheet 6
GPB3_W: U7.3(GPB3)
GPB4_W: U7.4(GPB4)
GPB5_W: U7.5(GPB5)
GPB6_W: U7.6(GPB6)
GPB7_W: U7.7(GPB7)
N$1: C49.1 L9.1 MXS.8(VOUT) R41.1
N$46: MXS.7(ADJ) R41.2 R42.1
N$47: C50.1 MXS.6(CDELAY)
N$1023: R71.1 U14.6(ASEL)
N$1945: R74.1 U15.6(ASEL)
N$3234: C52.1 L10.1 MCS.8(VOUT) R43.1
N$3235: MCS.7(ADJ) R43.2 R44.1
N$3236: C53.1 MCS.6(CDELAY)
N$3240: R89.1 U22.6(ASEL)
N$3425: C55.1 L11.1 R45.1 VIO.8(VOUT)
N$3426: R45.2 R46.1 VIO.7(ADJ)
N$3427: C56.1 VIO.6(CDELAY)
N$3616: C58.1 L12.1 MCN.8(VOUT) R47.1
N$3617: MCN.7(ADJ) R47.2 R48.1
N$3618: C59.1 MCN.6(CDELAY)
N$3807: C61.1 L13.1 MXN.8(VOUT) R49.1
N$3808: MXN.7(ADJ) R49.2 R50.1
N$3809: C62.1 MXN.6(CDELAY)
N$4041: R53.2 R54.1 U7.11(ADDR)
PCIE_N_V: R70.2 U14.4(SENSE2-) ; also sheet 2
PCIE_N_V': L13.2 R70.1 U14.3(SENSE2+)
PCIE_S_V: R73.2 U15.4(SENSE2-) ; also sheet 2
PCIE_S_V': L9.2 R73.1 U15.3(SENSE2+)
PMOD_SCL: U7.9(SCL) U14.9(SMCLK) U15.9(SMCLK) U22.9(SMCLK) ; also sheet 5,6,7,8,9
PMOD_SDA: U7.10(SDA) U14.8(SMDATA) U15.8(SMDATA) U22.8(SMDATA) ; also sheet 5,6,7,8,9
VCC: R53.1 U7.8(VDD) U7.12(!RESET) U14.10(VDD) U15.10(VDD) U22.10(VDD) ; also sheet 5,6,7,8,9
VCCIO: L11.2 ; also sheet 5,9
ZED_5V: R87.1 U22.1(SENSE1+) ; also sheet 5
ZED_5V': R87.2 U22.2(SENSE1-) ; also sheet 1
Unconnected: U7.13(INTB) U7.14(INTA) U14.7(!ALERT) U15.7(!ALERT) U22.7(!ALERT)

### Notes on the sheet
- AXIOM Beta Test
- Power, Control and Sensing
- Copyright (C) 2015 H.Poetzl
  Licensed under CERN OHL v.1.2

## Library data of the parts
BETA ZED = microzed:µZ-FCI
C1 C2 C4-C88 = generic-rcl:C
C3 R1-R114 = generic-rcl:R
EE MCN MCS MXN MXS NE NN NW NW1 NW2 SE SE1 SE2 SS SW VIO WW = mcp1727:MCP1727-ADJE/MF: IC, 1.5A, ADJ,Low Voltage, Low Quiescent Current LDO Regulator,DFN-8; MPN: MCP1727-ADJE/MF; OC_FARNELL: 1851979; OC_NEWARK: 74K5374; PACKAGE: DFN-8; SUPPLIER: Microchip
FB1-FB3 = microbuilder:FERRITE: Ferrite Bead 0603 MMZ1608B121C - 120 Ohm @ 100MHz, 600mA, 0.15 Ohm DC Resistance - Digikey: 445-2164-1-ND BK1608HW121-T - 120 Ohm, 600mA Ferrite Chip - Digikey: 587-1876-2-ND 0805 HZ0805B272R-10 - 2.7K Ohm @ 100MHz, 200mA, 0.8 Ohm DC Resistance - Digikey: 240-2504-1-ND (see also Murata BLM21BD272SN1L) MMZ2012Y152B - 1.5K Ohm @ 100MHz, 500mA, 0.4 Ohm DC Resistance - Digikey: 445-1560-1-ND - Mainly for high frequency (80-400MHz) MMZ2012R102A - 1K Ohm @ 100MHz, 500mA, 0.3 Ohm DC Resistance - Digikey: 445-1555-2-ND - More general purpose (10-200MHz)
JP1 = pinhead-2:PINHD-1X02: PIN HEADER
L1-L18 = generic-rcl:L
MNW MSE = spx3819:SPX3819M5-L: 500mA, LOW-NOISE LDO VOLTAGE REGULATOR; MPN: SPX3819M5-L; OC_FARNELL: 1831948; OC_NEWARK: 23R9689; PACKAGE: SOT-23-5; SUPPLIER: EXAR
PB-NW PB-SE = df12:DF12(XX)-20DP-0.5V
PWR-NE PWR-NW PWR-SE PWR-SW = pincon:PINRC-2X04: WR-PHD 2.54mm SMT Dual Socket Header Bottom Entry, 8 Pins=>Code : Con_BTB_SHD_2.54_2_610008243021 <http://katalog.we-online.de/media/images/eican/Con_BTB_SHD_2.54_2_6100xx243021_pf2.jpg> Details see: http://katalog.we-online.de/en/em/610_0xx_243_021 Created 2014-05-30, Karrer Zheng 2014 (C) Würth Elektronik
Q1 = xtal:SMD-4P-2G
TP0 TP1-TP3 VP+ VP- = testpad:TP: Test pad
TR1-TR8 = paul:PVZ2A
U1 = ft232h:FT232H: FTDI FT232H DS: http://www.ftdichip.com/Support/Documents/DataSheets/ICs/DS_FT232H.pdf
U2 = 93lc46:93LC46BT-I/OT: 1K Microwire Compatible Serial EEPROM; MPN: 93LC46BT-I/OT; OC_FARNELL: 1556164; OC_NEWARK: 75M3689; PACKAGE: SOT-6; SUPPLIER: Microchip
U3 = esd:TPD3E001DRLR: LOW-CAPACITANCE 3-CHANNEL ±15-kV ESD-PROTECTION ARRAY FOR HIGH-SPEED DATA INTERFACES; MPN: TPD3E001DRLR; OC_FARNELL: 1603422; OC_NEWARK: 41M5842; PACKAGE: SOT-5; SUPPLIER: Texas Instruments
U4 U5 U25 = gtl2002:GTL2002: Bidirectional low voltage translator,SOIC-8
U6 U7 = microchip-exp:MCP23018: http://ww1.microchip.com/downloads/en/DeviceDoc/22103a.pdf Source: http://ww1.microchip.com/downloads/en/DeviceDoc/22103a.pdf Adopted by RobG
U8 U9 = mcp23009:MCP23009: IC, I/O EXPANDER, 8BIT, 3.4MHZ,
U10-U13 = ldo:LDO_DUAL: Dual Output SOT23-6 Linear Regulators Diodes Inc. AP7312 - Dual 150mA LDO Linear Regulator 0.2V dropout, 150mA output, 2-6V Input AP7312-1833W6-7 - 1.8V/3.3V SOT23-6 (Digikey: AP7312-1833W6-7DICT-ND) MIC5320 - Dual 150mA ULDO Linear Regulator Ultra-low 35mV dropout at 150mA, 2.3-5.5V Input 3.3V/1.8V SOT23-6 (Digikey: 576-1658-1-ND) 3.3V/1.5V SOT23-6 (Digikey: 576-3483-1-ND)
U14-U24 = pac1720:PAC1720
U26 = ld1117:LD1117: Low Drop Fixed And Adjustable Positive Voltage Regulators http://www.datasheetcatalog.org/datasheet/SGSThomsonMicroelectronics/mXuqtqv.pdf
U44 = pca9540:PCA9540: IC,2-channel I²C-bus multiplexer, 8TSSOP; MPN: PCA9540BDP; OC_FARNELL: 2212116; OC_NEWARK: 55W4318; PACKAGE: TSSOP8; SUPPLIER: NXP
U99 = emifil:IP4251CZ16-8-TTL: passive filter network; MPN: IP4251CZ16-8-TTL; OC_FARNELL: 1972684; OC_NEWARK: 58T9585; PACKAGE: SON-16; SUPPLIER: NXP
U$1 = micro-sd:MICRO-SD-2CD
USB = usb:5_USB_3S; TE: 1981584
X1 = pico-spox:PICO-SPOX-5

## Net classes
1 LVDS: width 0.152 mm, drill 0.254 mm, clearance 0.152 mm